# EAGLE design Estimulema v2 (EAGLE 9.2.2)

## Sheet 1 of 5
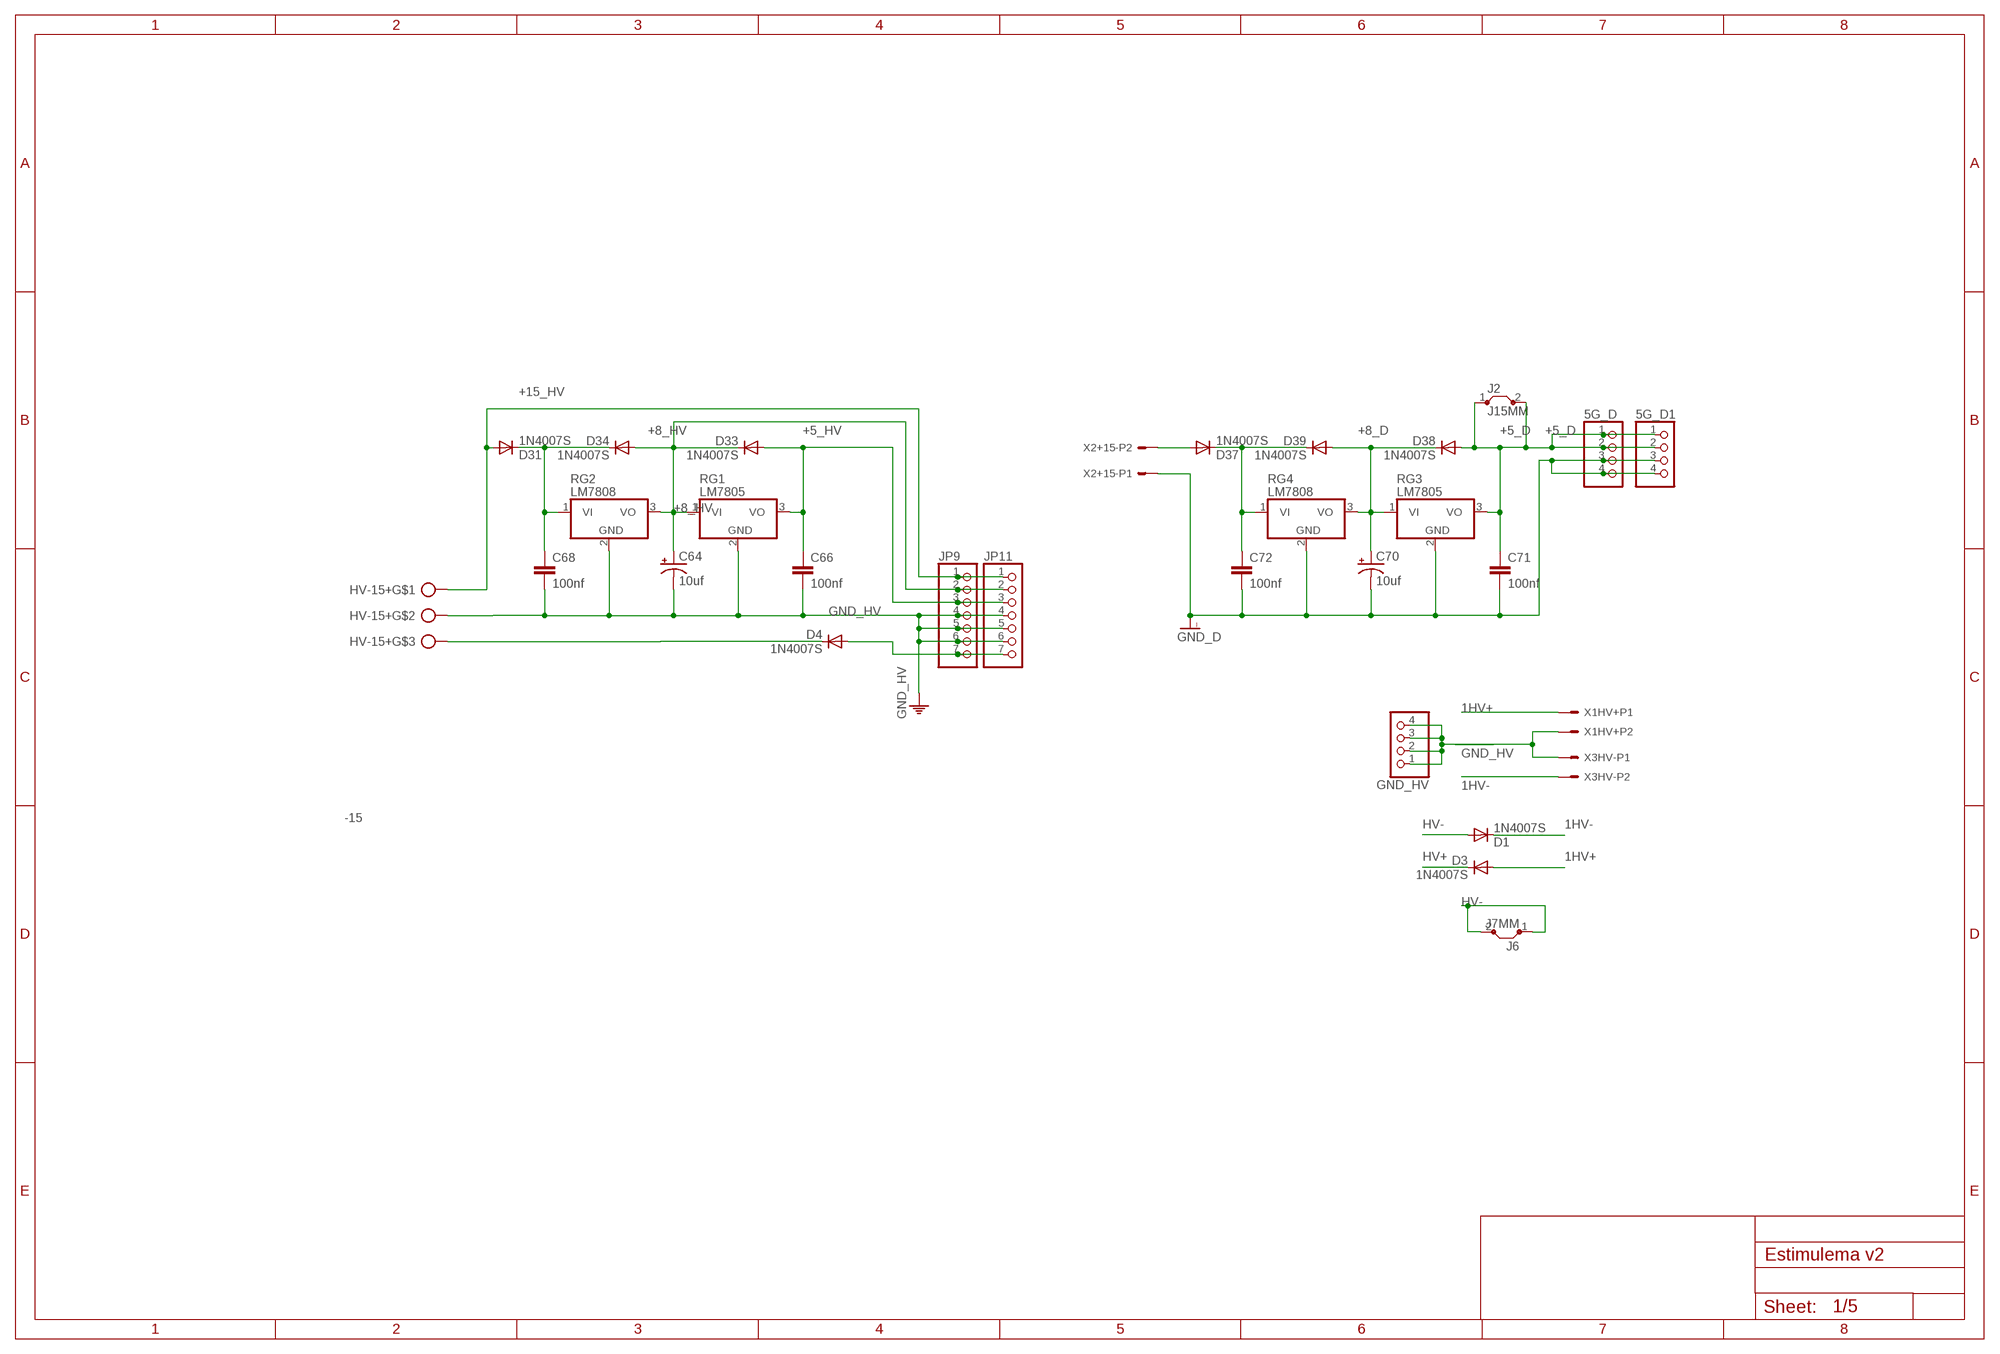
[diagram p0: schematic, sheet 1]

### Parts
5G_D  PINHD-1X4  [1X04]
5G_D1  PINHD-1X4  [1X04]
C64  10uf  CPOL-USE2-5  [E2-5]
C66  100nf  C-EU025-025X050  [C025-025X050]
C68  100nf  C-EU025-025X050  [C025-025X050]
C70  10uf  CPOL-USE2-5  [E2-5]
C71  100nf  C-EU025-025X050  [C025-025X050]
C72  100nf  C-EU025-025X050  [C025-025X050]
D1  1N4007S  DIODOWEB  [RESM4226X229]
D3  1N4007S  DIODOWEB  [RESM4226X229]
D4  1N4007S  DIODOWEB  [RESM4226X229]
D31  1N4007S  DIODOWEB  [RESM4226X229]
D33  1N4007S  DIODOWEB  [RESM4226X229]
D34  1N4007S  DIODOWEB  [RESM4226X229]
D37  1N4007S  DIODOWEB  [RESM4226X229]
D38  1N4007S  DIODOWEB  [RESM4226X229]
D39  1N4007S  DIODOWEB  [RESM4226X229]
GND_HV  PINHD-1X4  [1X04]
HV-15+  CONECTOR_3_PTR500  [PTR_AK300/3]
J2  J15MM  JUMPERS15MM  [15]
J6  J7MM  JUMPERS7MM  [07]
JP9  PINHD-1X7  [1X07]
JP11  PINHD-1X7  [1X07]
RG1  LM7805  78XX_V2  [TO220V]
RG2  LM7808  78XX_V2  [TO220V]
RG3  LM7805  78XX_V2  [TO220V]
RG4  LM7808  78XX_V2  [TO220V]
X1HV+  CONECTOR_5.08  [CONECTOR_X2_5.08]
X2+15-  CONECTOR_5.08  [CONECTOR_X2_5.08]
X3HV-  CONECTOR_5.08  [CONECTOR_X2_5.08]

### Nets
1HV+ [GND_D]: D3.AN(A) X1HV+.1
1HV- [GND_D]: D1.CA(C) X3HV-.2
+5_D [+5_D]: 5G_D1.1 5G_D1.2 5G_D.1 5G_D.2 C71.1 D38.AN(A) J2.1 J2.2 RG3.3(VO) ; also sheet 2,5
+5_HV [+5_D]: C66.1 D33.AN(A) JP9.3 JP11.3 RG1.3(VO) ; also sheet 2
+8_D [SIGNAL]: C70.+ D38.CA(C) D39.AN(A) RG3.1(VI) RG4.3(VO)
+8_HV [SIGNAL]: C64.+ D33.CA(C) D34.AN(A) JP9.2 JP11.2 RG1.1(VI) RG2.3(VO)
+15_HV [SIGNAL]: D31.AN(A) HV-15+.1 JP9.1 JP11.1 ; also sheet 3,4
-15 [SIGNAL]: D4.CA(C) HV-15+.3
-15_HV [SIGNAL]: D4.AN(A) JP9.7 JP11.7 ; also sheet 3,4
GND_D [GND_D]: 5G_D1.3 5G_D1.4 5G_D.3 5G_D.4 C70.- C71.2 C72.2 RG3.2(GND) RG4.2(GND) X2+15-.1 ; also sheet 2,5
GND_HV [GND_HV]: C64.- C66.2 C68.2 GND_HV.1 GND_HV.2 GND_HV.3 GND_HV.4 HV-15+.2 JP9.4 JP9.5 JP9.6 JP11.4 JP11.5 JP11.6 RG1.2(GND) RG2.2(GND) X1HV+.2 X3HV-.1 ; also sheet 2,3,4,5
HV+ [GND_D]: D3.CA(C) ; also sheet 3,4
HV- [GND_D]: D1.AN(A) J6.1 J6.2 ; also sheet 3,4
N$9: D37.AN(A) X2+15-.2
N$157 [SIGNAL]: C68.1 D31.CA(C) D34.CA(C) RG2.1(VI)
N$158 [SIGNAL]: C72.1 D37.CA(C) D39.CA(C) RG4.1(VI)

## Sheet 2 of 5
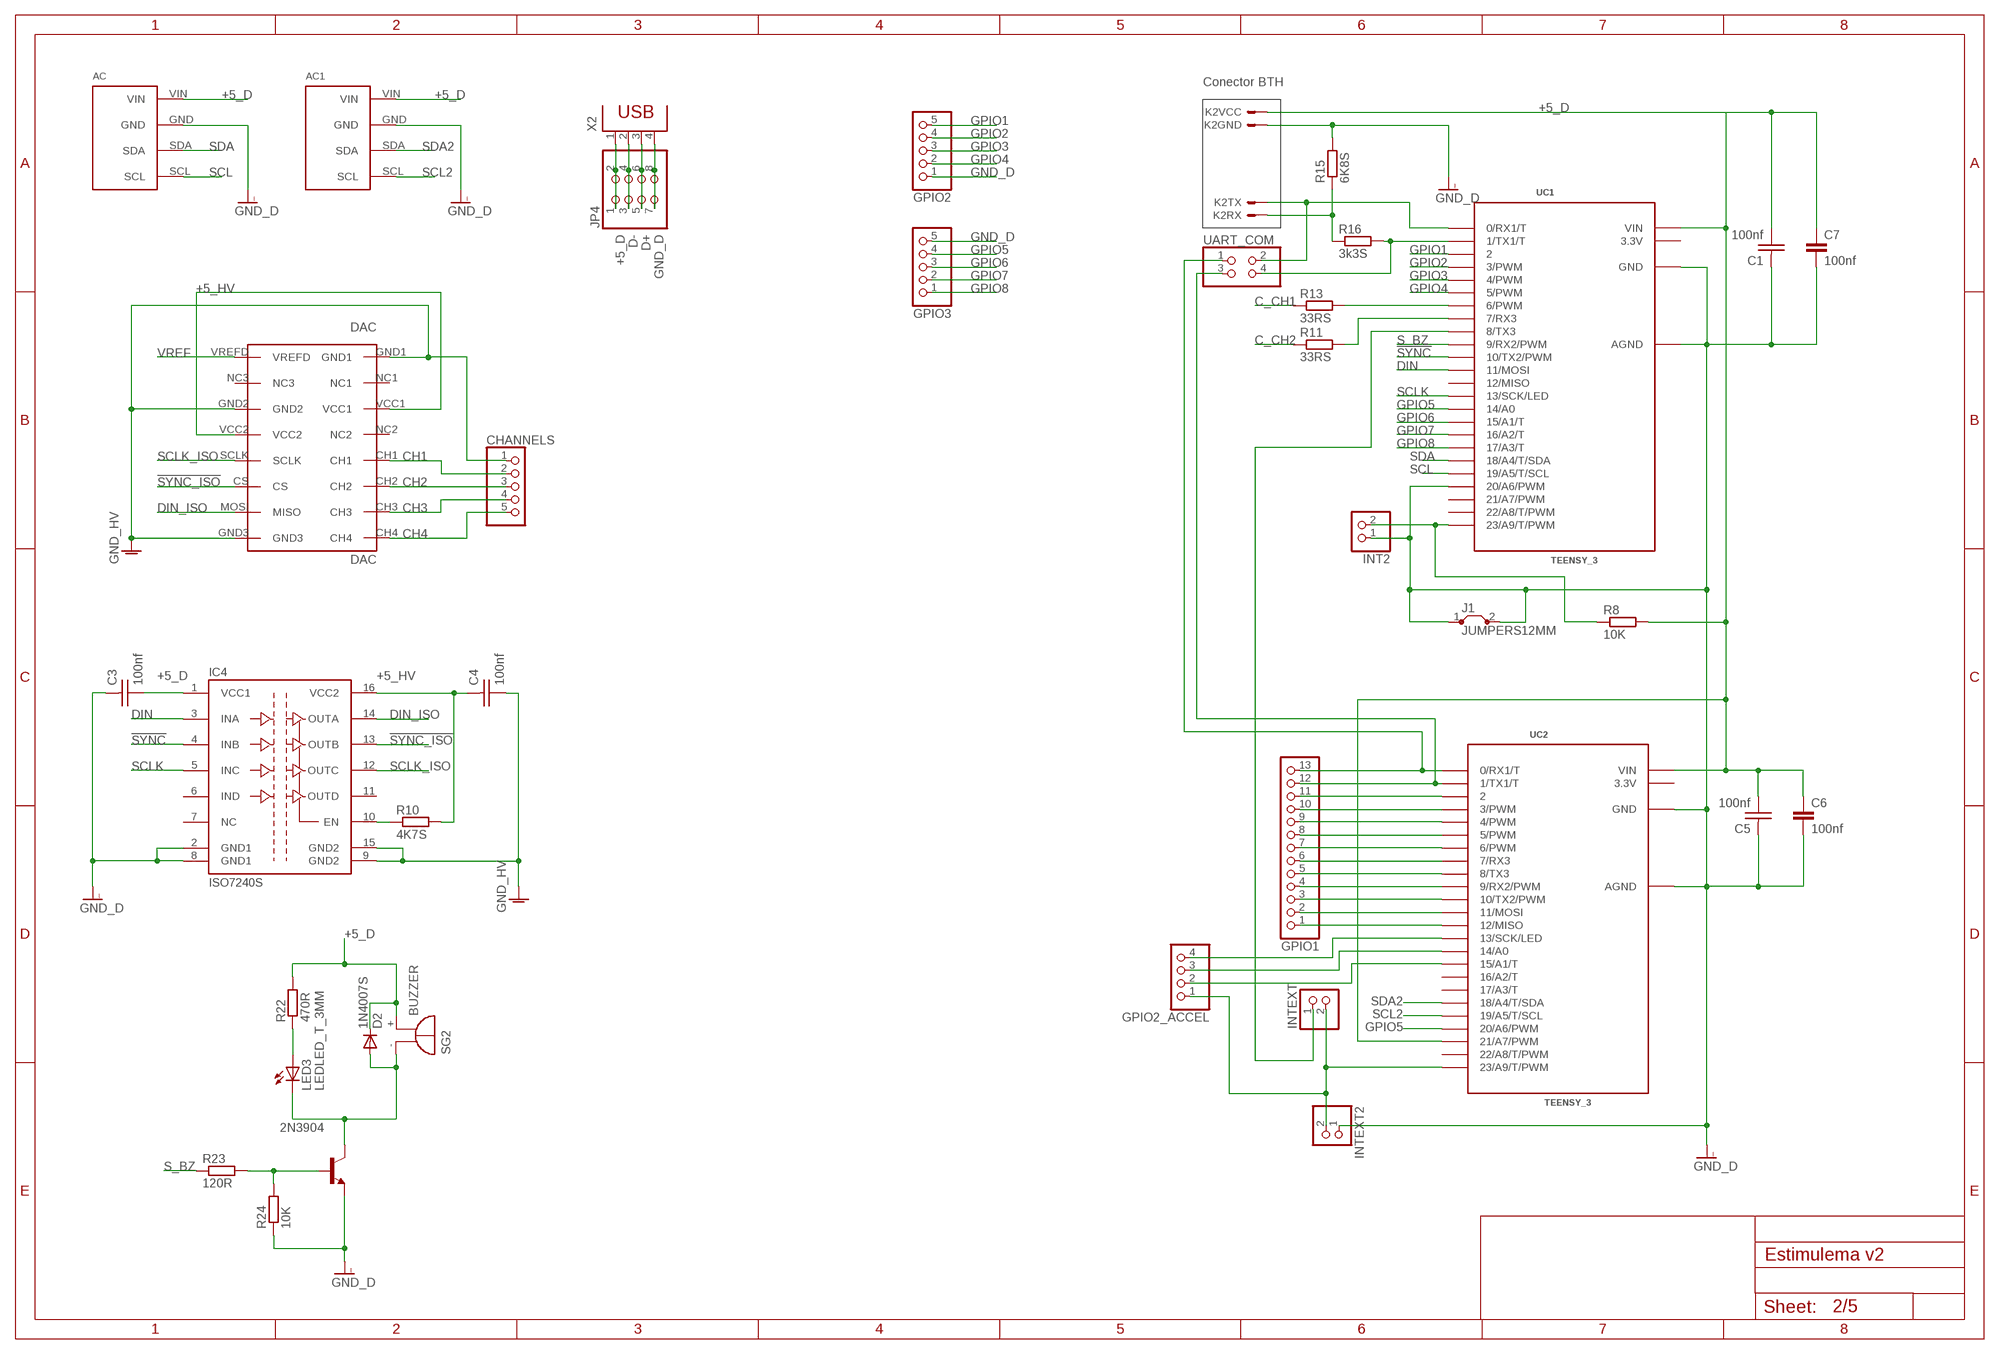
[diagram p1: schematic, sheet 2]

### Parts
2N3904  29-NPN-TO92-EBC  [TO92-EBC]
AC  CONECTOR_ACELEROMETRO_MPU6050CONECTOR_MPU6050  [MPU6050]
AC1  MPU6050  CONECTOR_ACELEROMETRO_MPU6050CONECTOR_MPU6050  [MPU6050]
C1  100nf  CAP_CERAMICO_SMD  [CAP_CER_SMD-0805]
C3  100nf  CAP_CERAMICO_SMD  [CAP_CER_SMD-0805]
C4  100nf  CAP_CERAMICO_SMD  [CAP_CER_SMD-0805]
C5  100nf  CAP_CERAMICO_SMD  [CAP_CER_SMD-0805]
C6  100nf  C-EU025-025X050  [C025-025X050]
C7  100nf  C-EU025-025X050  [C025-025X050]
CHANNELS  PINHD-1X5  [1X05]
D2  1N4007S  DIODOWEB  [RESM4226X229]
DAC  DAC  DAC_MODULE  [DACMOD_P]
GPIO1  PINHD-1X13  [1X13]
GPIO2  PINHD-1X5  [1X05]
GPIO2_ACCEL  PINHD-1X4  [1X04]
GPIO3  PINHD-1X5  [1X05]
IC4  ISO7240S  ISO7240_SMDDW  [SO-16DW]
INT2  PINHD-1X2  [1X02]
INTEXT  PINHD-1X2  [1X02]
INTEXT2  PINHD-1X2  [1X02]
J1  JUMPERS12MM  [12]
JP4  PINHD-2X4  [2X04]
K2  HC-06  CONECTOR_BTHC-06HC-06  [CONECTOR_BTHC-06]
LED3  LEDLED_T_3MM  [LED3MM]
R8  10K  RESISTORSMD_0805  [RESISTENCIA_0805]
R10  4K7S  RESISTORSMD_0805  [RESISTENCIA_0805]
R11  33RS  RESISTORSMD_0805  [RESISTENCIA_0805]
R13  33RS  RESISTORSMD_0805  [RESISTENCIA_0805]
R15  6K8S  RESISTORSMD_0805  [RESISTENCIA_0805]
R16  3k3S  RESISTORSMD_0805  [RESISTENCIA_0805]
R22  470R  RESISTORSMD_0805  [RESISTENCIA_0805]
R23  120R  RESISTORSMD_0805  [RESISTENCIA_0805]
R24  10K  RESISTORSMD_0805  [RESISTENCIA_0805]
SG2  BUZZER  [BUZZER]
UART_COM  PINHD-2X2  [2X02]
UC1  TEENSY_3  TEENSY_3.0_A_3.2VERSION_MINIMA  [TEENSY_3.0-3.2_DIL]
UC2  TEENSY_3  TEENSY_3.0_A_3.2VERSION_MINIMA  [TEENSY_3.0-3.2_DIL]
X2  PN61729  [PN61729]

### Nets
!SYNC [SIGNAL]: IC4.4(INB) UC1.10(10/TX2/PWM)
!SYNC_ISO [SIGNAL]: DAC.CS IC4.13(OUTB)
+5_D [+5_D]: AC1.VIN AC.VIN C1.2 C3.2 C5.2 C6.1 C7.1 D2.CA(C) IC4.1(VCC1) JP4.1 JP4.2 K2.1 R8.2 R22.2 SG2.+(-) UC1.VIN UC2.21/A7(21/A7/PWM) UC2.VIN X2.1 ; also sheet 1,5
+5_HV [+5_D]: C4.1 DAC.VCC1 DAC.VCC2 IC4.16(VCC2) R10.2 ; also sheet 1
C_15D [SIGNAL]: GPIO1.11 UC2.2
C_CH1 [SIGNAL]: R13.1 ; also sheet 5
C_CH2 [SIGNAL]: R11.1 ; also sheet 5
CH1 [SIGNAL]: CHANNELS.2 DAC.CH1 ; also sheet 3
CH2 [SIGNAL]: CHANNELS.3 DAC.CH2 ; also sheet 4
CH3 [SIGNAL]: CHANNELS.4 DAC.CH3
CH4 [SIGNAL]: CHANNELS.5 DAC.CH4
D+ [SIGNAL]: JP4.5 JP4.6 X2.3
D- [SIGNAL]: JP4.3 JP4.4 X2.2
DIN [SIGNAL]: IC4.3(INA) UC1.11(11/MOSI)
DIN_ISO [SIGNAL]: DAC.MOSI(MISO) IC4.14(OUTA)
GND_D [GND_D]: 2N3904.E AC1.GND AC.GND C1.1 C3.1 C5.1 C6.2 C7.2 GPIO2.1 GPIO3.5 IC4.2(GND1) IC4.8(GND1) INT2.1 INTEXT2.1 J1.1 J1.2 JP4.7 JP4.8 K2.2 R15.2 R24.1 UC1.20/A6(20/A6/PWM) UC1.AGND UC1.GND UC2.AGND UC2.GND X2.4 ; also sheet 1,5
GND_HV [GND_HV]: C4.2 CHANNELS.1 DAC.GND1 DAC.GND2 DAC.GND3 IC4.9(GND2) IC4.15(GND2) ; also sheet 1,3,4,5
GPIO1 [SIGNAL]: GPIO2.5 UC1.2
GPIO2 [SIGNAL]: GPIO2.4 UC1.3(3/PWM)
GPIO3 [SIGNAL]: GPIO2.3 UC1.4(4/PWM)
GPIO4 [SIGNAL]: GPIO2.2 UC1.5(5/PWM)
GPIO5 [SIGNAL]: GPIO3.4 UC1.14/A0 UC2.20/A6(20/A6/PWM)
GPIO6 [SIGNAL]: GPIO3.3 UC1.15/A1(15/A1/T)
GPIO7 [SIGNAL]: GPIO3.2 UC1.16/A2(16/A2/T)
GPIO8 [SIGNAL]: GPIO3.1 UC1.17/A3(17/A3/T)
N$1: GPIO2_ACCEL.1 INTEXT2.2 INTEXT.2 UC2.23/A9(23/A9/T/PWM)
N$5: INTEXT.1 UC1.8(8/TX3)
N$6: GPIO1.13 UART_COM.1 UC2.0(0/RX1/T)
N$7: GPIO1.12 UART_COM.3 UC2.1(1/TX1/T)
N$10: GPIO1.10 UC2.3(3/PWM)
N$11: GPIO1.9 UC2.4(4/PWM)
N$12: GPIO1.8 UC2.5(5/PWM)
N$14: GPIO1.7 UC2.6(6/PWM)
N$15: GPIO1.6 UC2.7(7/RX3)
N$19: GPIO1.5 UC2.8(8/TX3)
N$20: GPIO1.4 UC2.9(9/RX2/PWM)
N$21: GPIO1.3 UC2.10(10/TX2/PWM)
N$22: GPIO1.2 UC2.11(11/MOSI)
N$23: GPIO1.1 UC2.12(12/MISO)
N$36: R16.2 UART_COM.4 UC1.1(1/TX1/T)
N$37: GPIO2_ACCEL.4 UC2.13(13/SCK/LED)
N$38: K2.3 UART_COM.2 UC1.0(0/RX1/T)
N$39: GPIO2_ACCEL.3 UC2.14/A0
N$40: GPIO2_ACCEL.2 UC2.15/A1(15/A1/T)
N$66 [SIGNAL]: IC4.10(EN) R10.1
N$69 [SIGNAL]: K2.4 R15.1 R16.1
N$72 [SIGNAL]: LED3.A R22.1
N$73 [SIGNAL]: 2N3904.C D2.AN(A) LED3.K(C) SG2.-(+)
N$74 [SIGNAL]: 2N3904.B R23.2 R24.2
N$75 [SIGNAL]: INT2.2 R8.1 UC1.23/A9(23/A9/T/PWM)
RL1 [SIGNAL]: R13.2 UC1.6(6/PWM)
RL2 [SIGNAL]: R11.2 UC1.7(7/RX3)
S_BZ [SIGNAL]: R23.1 UC1.9(9/RX2/PWM)
SCL [SIGNAL]: AC.SCL UC1.19/A5(19/A5/T/SCL)
SCL2: AC1.SCL UC2.19/A5(19/A5/T/SCL)
SCLK [SIGNAL]: IC4.5(INC) UC1.13(13/SCK/LED)
SCLK_ISO [SIGNAL]: DAC.SCLK IC4.12(OUTC)
SDA [SIGNAL]: AC.SDA UC1.18/A4(18/A4/T/SDA)
SDA2: AC1.SDA UC2.18/A4(18/A4/T/SDA)
VREF [SIGNAL]: DAC.VREFD ; also sheet 3,4
Unconnected: DAC.NC1 DAC.NC2 DAC.NC3 IC4.6(IND) IC4.7(NC) IC4.11(OUTD) UC1.12(12/MISO) UC1.21/A7(21/A7/PWM) UC1.22/A8(22/A8/T/PWM) UC2.16/A2(16/A2/T) UC2.17/A3(17/A3/T) UC2.22/A8(22/A8/T/PWM)

### Notes on the sheet
- Conector BTH

## Sheet 3 of 5
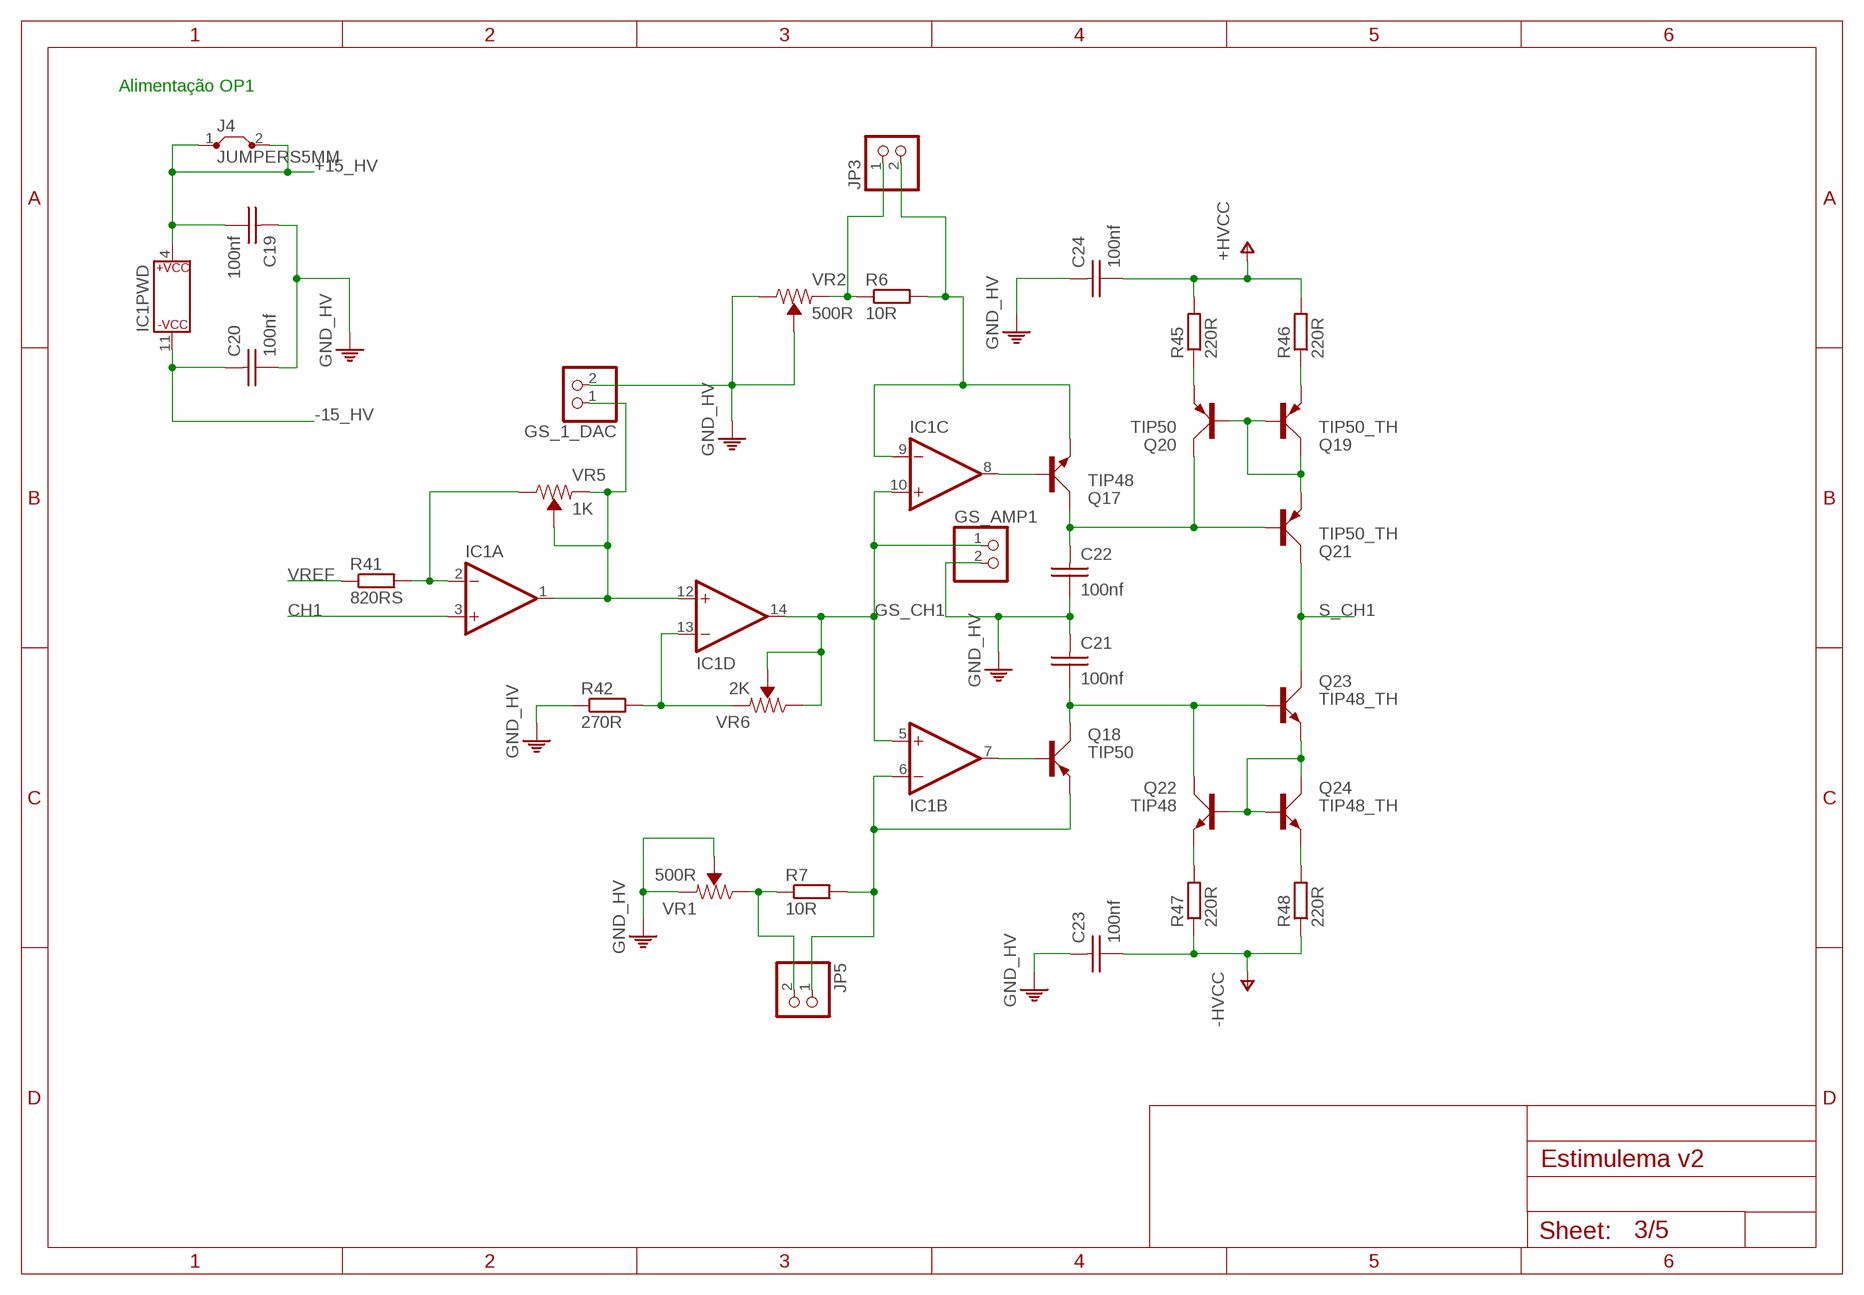
[diagram p2: schematic, sheet 3]

### Parts
C19  100nf  CAP_CERAMICO_SMD  [CAP_CER_SMD-0805]
C20  100nf  CAP_CERAMICO_SMD  [CAP_CER_SMD-0805]
C21  100nf  CAP_CERAMICO_TH2  [CAP_CER_2,54-5X5]
C22  100nf  CAP_CERAMICO_TH2  [CAP_CER_2,54-5X5]
C23  100nf  CAP_CERAMICO_TH16  [CAP_CER_16X7]
C24  100nf  CAP_CERAMICO_TH16  [CAP_CER_16X7]
GS_1_DAC  PINHD-1X2  [1X02]
GS_AMP1  PINHD-1X2  [1X02]
IC1  TL084DIL143D  [DIL14]
J4  JUMPERS5MM  [05]
JP3  PINHD-1X2  [1X02]
JP5  PINHD-1X2  [1X02]
Q17  TIP48  TIP48_TH  [TO220]
Q18  TIP50  TIP50_TH  [TO220]
Q19  TIP50_TH  [TO220]
Q20  TIP50  TIP50_TH  [TO220]
Q21  TIP50_TH  [TO220]
Q22  TIP48  TIP48_TH  [TO220]
Q23  TIP48_TH  [TO220]
Q24  TIP48_TH  [TO220]
R6  10R  RESISTORSMD_0805  [RESISTENCIA_0805]
R7  10R  RESISTORSMD_0805  [RESISTENCIA_0805]
R41  820RS  RESISTORSMD_0805  [RESISTENCIA_0805]
R42  270R  RESISTORSMD_0805  [RESISTENCIA_0805]
R45  220R  RESISTORT_CORTO  [0204V]
R46  220R  RESISTORT_CORTO  [0204V]
R47  220R  RESISTORT_CORTO  [0204V]
R48  220R  RESISTORT_CORTO  [0204V]
VR1  500R  TRIMPOT_TH  [TRIMPOT-PTH-3386U]
VR2  500R  TRIMPOT_TH  [TRIMPOT-PTH-3386U]
VR5  1K  TRIMPOT_TH  [TRIMPOT-PTH-3386U]
VR6  2K  TRIMPOT_TH  [TRIMPOT-PTH-3386U]

### Nets
+15_HV [SIGNAL]: C19.2 IC1.4(PWD:P$V+) J4.1 J4.2 ; also sheet 1,4
-15_HV [SIGNAL]: C20.1 IC1.11(PWD:P$V-) ; also sheet 1,4
CH1 [SIGNAL]: IC1.3(A:+IN) ; also sheet 2
GND_HV [GND_HV]: C19.1 C20.2 C21.1 C22.2 C23.1 C24.1 GS_1_DAC.2 GS_AMP1.2 R42.1 VR1.1(CCW) VR1.2(WIPER) VR2.2(WIPER) VR2.3(CW) ; also sheet 1,2,4,5
GS_CH1 [SIGNAL]: GS_AMP1.1 IC1.5(B:+IN) IC1.10(C:+IN) IC1.14(D:OUT) VR6.2(WIPER) VR6.3(CW)
HV+ [GND_D]: C24.2 R45.2 R46.2 ; supply symbol labelled +HVCC ; also sheet 1,4
HV- [GND_D]: C23.2 R47.1 R48.1 ; supply symbol labelled -HVCC ; also sheet 1,4
N$24: JP5.2 R7.1 VR1.3(CW)
N$27: JP3.1 R6.1 VR2.1(CCW)
N$106 [SIGNAL]: IC1.2(A:-IN) R41.2 VR5.3(CW)
N$107 [SIGNAL]: GS_1_DAC.1 IC1.1(A:OUT) IC1.12(D:+IN) VR5.1(CCW) VR5.2(WIPER)
N$108 [SIGNAL]: IC1.13(D:-IN) R42.2 VR6.1(CCW)
N$109 [SIGNAL]: IC1.9(C:-IN) JP3.2 Q17.E R6.2
N$110 [SIGNAL]: IC1.6(B:-IN) JP5.1 Q18.E R7.2
N$111 [SIGNAL]: C21.2 Q18.C Q22.C Q23.B
N$112 [SIGNAL]: C22.1 Q17.C Q20.C Q21.B
N$113 [SIGNAL]: Q20.E R45.1
N$114 [GND_HV1]: Q19.E R46.1
N$115 [GND_HV1]: Q19.B Q19.C Q20.B Q21.E
N$116 [GND_HV1]: Q22.B Q23.E Q24.B Q24.C
N$117 [SIGNAL]: Q22.E R47.2
N$118 [GND_HV1]: Q24.E R48.2
N$119 [SIGNAL]: IC1.8(C:OUT) Q17.B
N$120 [SIGNAL]: IC1.7(B:OUT) Q18.B
S_CH1 [GND_HV1]: Q21.C Q23.C ; also sheet 5
VREF [SIGNAL]: R41.1 ; also sheet 2,4

### Notes on the sheet
- Alimentação OP1

## Sheet 4 of 5
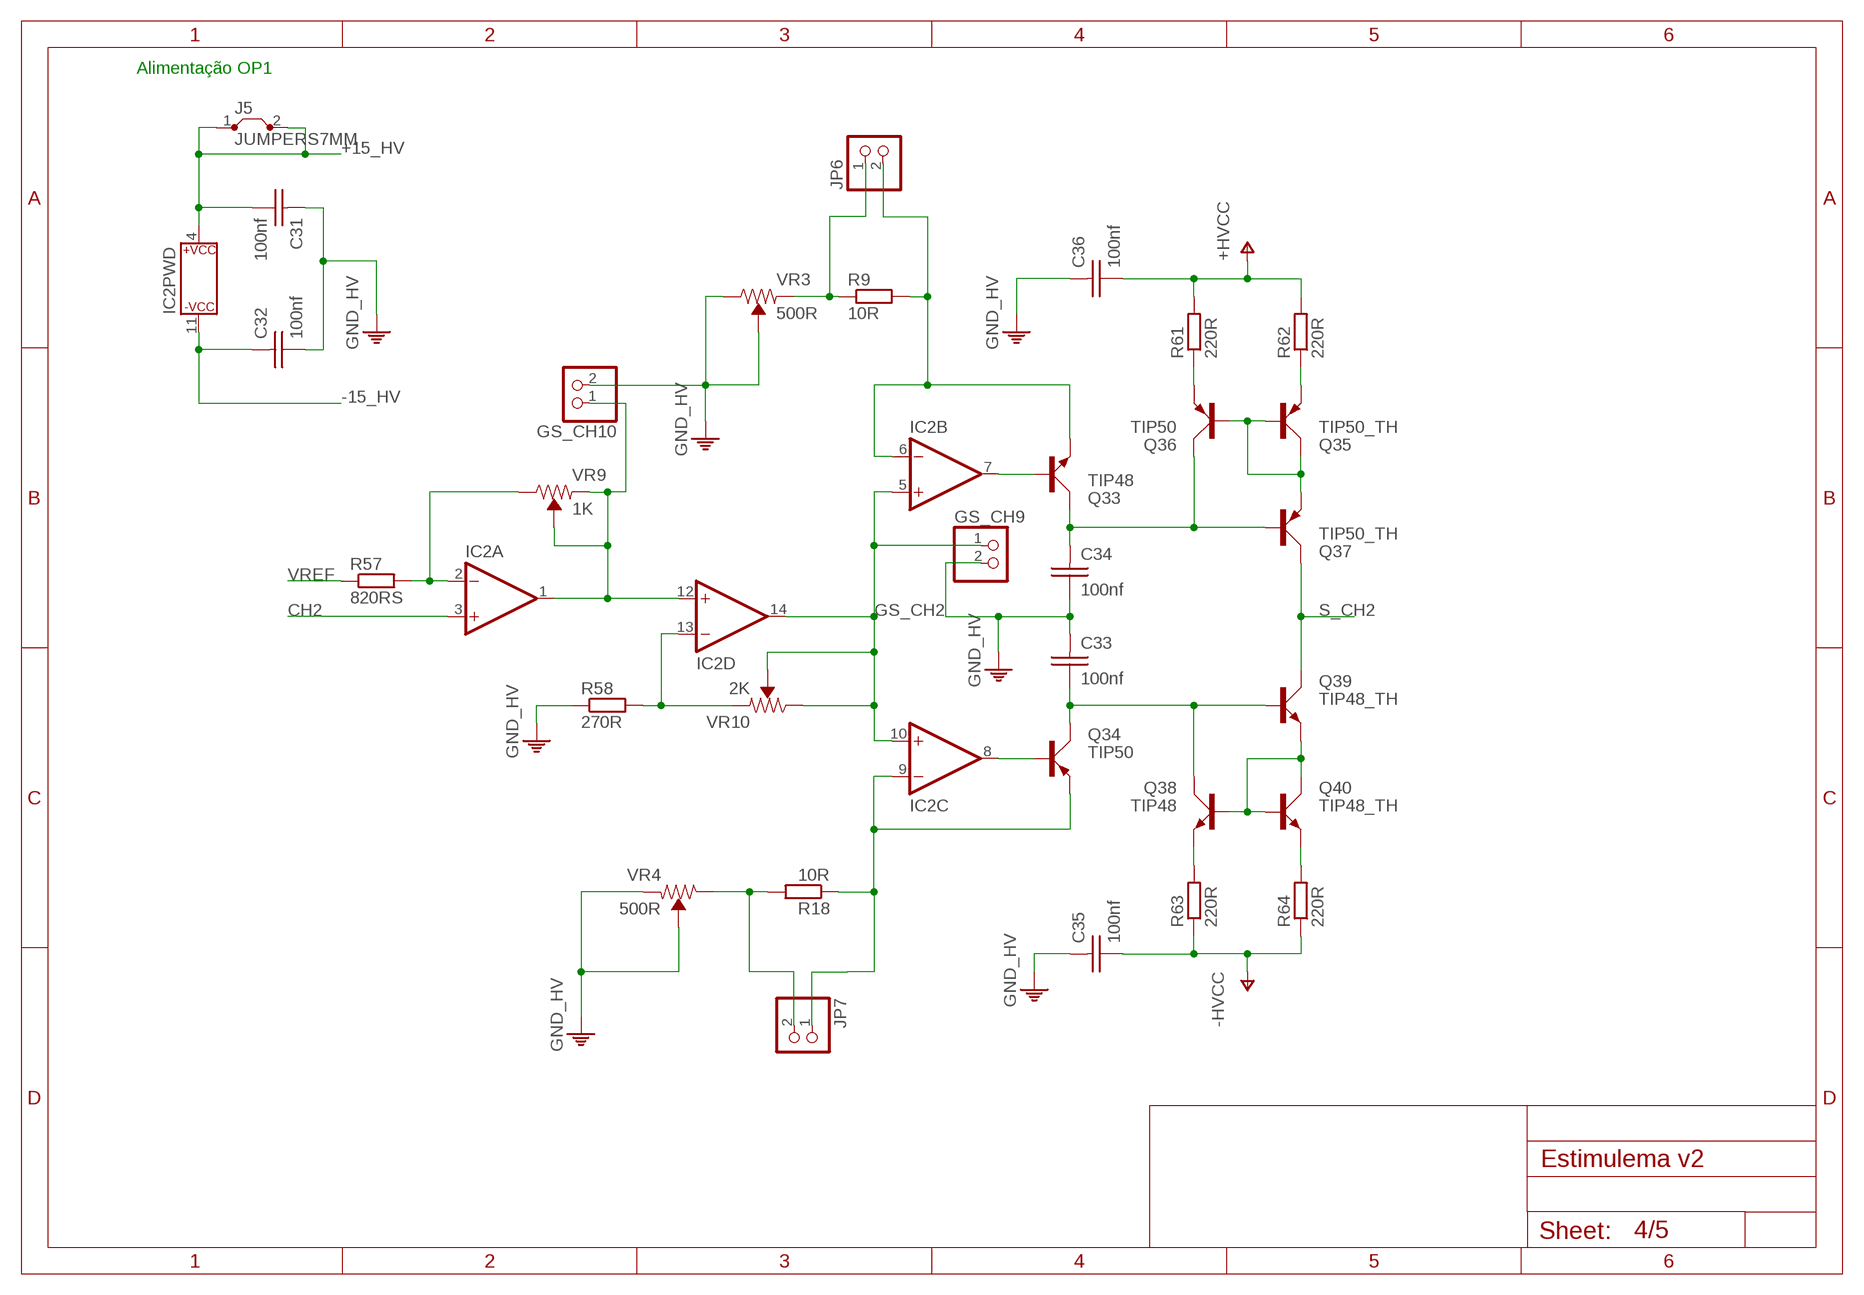
[diagram p3: schematic, sheet 4]

### Parts
C31  100nf  CAP_CERAMICO_SMD  [CAP_CER_SMD-0805]
C32  100nf  CAP_CERAMICO_SMD  [CAP_CER_SMD-0805]
C33  100nf  CAP_CERAMICO_TH2  [CAP_CER_2,54-5X5]
C34  100nf  CAP_CERAMICO_TH2  [CAP_CER_2,54-5X5]
C35  100nf  CAP_CERAMICO_TH16  [CAP_CER_16X7]
C36  100nf  CAP_CERAMICO_TH16  [CAP_CER_16X7]
GS_CH9  PINHD-1X2  [1X02]
GS_CH10  PINHD-1X2  [1X02]
IC2  TL084DIL143D  [DIL14]
J5  JUMPERS7MM  [07]
JP6  PINHD-1X2  [1X02]
JP7  PINHD-1X2  [1X02]
Q33  TIP48  TIP48_TH  [TO220]
Q34  TIP50  TIP50_TH  [TO220]
Q35  TIP50_TH  [TO220]
Q36  TIP50  TIP50_TH  [TO220]
Q37  TIP50_TH  [TO220]
Q38  TIP48  TIP48_TH  [TO220]
Q39  TIP48_TH  [TO220]
Q40  TIP48_TH  [TO220]
R9  10R  RESISTORSMD_0805  [RESISTENCIA_0805]
R18  10R  RESISTORSMD_0805  [RESISTENCIA_0805]
R57  820RS  RESISTORSMD_0805  [RESISTENCIA_0805]
R58  270R  RESISTORSMD_0805  [RESISTENCIA_0805]
R61  220R  RESISTORT_CORTO  [0204V]
R62  220R  RESISTORT_CORTO  [0204V]
R63  220R  RESISTORT_CORTO  [0204V]
R64  220R  RESISTORT_CORTO  [0204V]
VR3  500R  TRIMPOT_TH  [TRIMPOT-PTH-3386U]
VR4  500R  TRIMPOT_TH  [TRIMPOT-PTH-3386U]
VR9  1K  TRIMPOT_TH  [TRIMPOT-PTH-3386U]
VR10  2K  TRIMPOT_TH  [TRIMPOT-PTH-3386U]

### Nets
+15_HV [SIGNAL]: C31.2 IC2.4(PWD:P$V+) J5.1 J5.2 ; also sheet 1,3
-15_HV [SIGNAL]: C32.1 IC2.11(PWD:P$V-) ; also sheet 1,3
CH2 [SIGNAL]: IC2.3(A:+IN) ; also sheet 2
GND_HV [GND_HV]: C31.1 C32.2 C33.1 C34.2 C35.1 C36.1 GS_CH9.2 GS_CH10.2 R58.1 VR3.2(WIPER) VR3.3(CW) VR4.1(CCW) VR4.2(WIPER) ; also sheet 1,2,3,5
GS_CH2 [SIGNAL]: GS_CH9.1 IC2.5(B:+IN) IC2.10(C:+IN) IC2.14(D:OUT) VR10.2(WIPER) VR10.3(CW)
HV+ [GND_D]: C36.2 R61.2 R62.2 ; supply symbol labelled +HVCC ; also sheet 1,3
HV- [GND_D]: C35.2 R63.1 R64.1 ; supply symbol labelled -HVCC ; also sheet 1,3
N$28 [SIGNAL]: IC2.6(B:-IN) JP6.2 Q33.E R9.2
N$29: JP6.1 R9.1 VR3.1(CCW)
N$30 [SIGNAL]: JP7.2 R18.2 VR4.3(CW)
N$31: IC2.9(C:-IN) JP7.1 Q34.E R18.1
N$136 [SIGNAL]: IC2.2(A:-IN) R57.2 VR9.3(CW)
N$137 [SIGNAL]: GS_CH10.1 IC2.1(A:OUT) IC2.12(D:+IN) VR9.1(CCW) VR9.2(WIPER)
N$138 [SIGNAL]: IC2.13(D:-IN) R58.2 VR10.1(CCW)
N$141 [SIGNAL]: C33.2 Q34.C Q38.C Q39.B
N$142 [SIGNAL]: C34.1 Q33.C Q36.C Q37.B
N$143 [SIGNAL]: Q36.E R61.1
N$144 [GND_HV1]: Q35.E R62.1
N$145 [GND_HV1]: Q35.B Q35.C Q36.B Q37.E
N$146 [GND_HV1]: Q38.B Q39.E Q40.B Q40.C
N$147 [SIGNAL]: Q38.E R63.2
N$148 [GND_HV1]: Q40.E R64.2
N$149 [SIGNAL]: IC2.7(B:OUT) Q33.B
N$150 [SIGNAL]: IC2.8(C:OUT) Q34.B
S_CH2 [SIGNAL]: Q37.C Q39.C ; also sheet 5
VREF [SIGNAL]: R57.1 ; also sheet 2,3

### Notes on the sheet
- Alimentação OP1

## Sheet 5 of 5
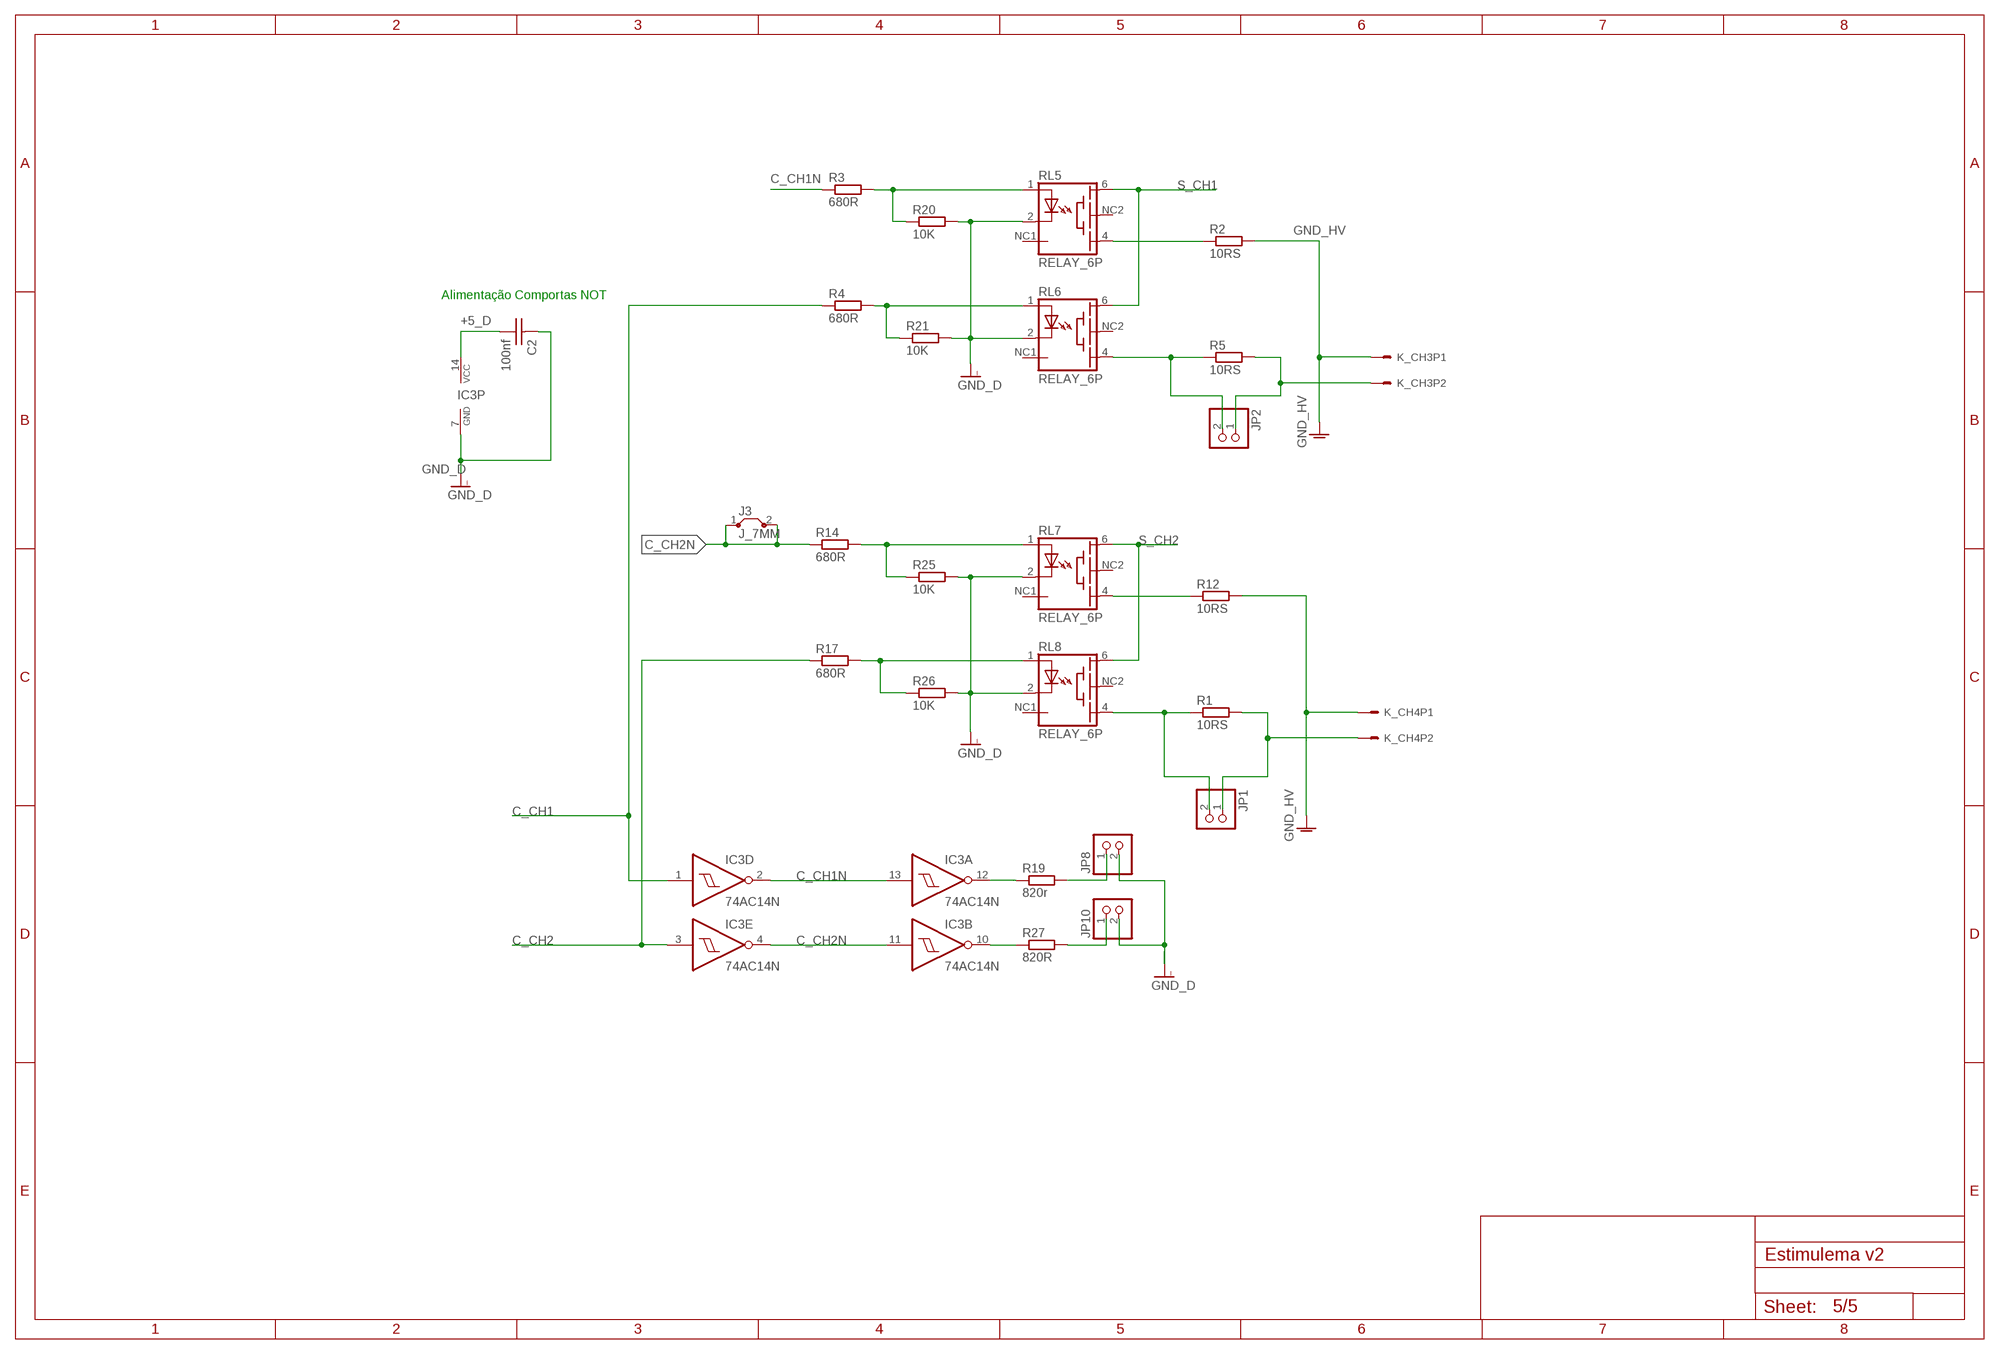
[diagram p4: schematic, sheet 5]

### Parts
C2  100nf  CAP_CERAMICO_SMD  [CAP_CER_SMD-0805]
IC3  74AC14N  [DIL14]
J3  J_7MM  JUMPERS7MM  [07]
JP1  PINHD-1X2  [1X02]
JP2  PINHD-1X2  [1X02]
JP8  PINHD-1X2  [1X02]
JP10  PINHD-1X2  [1X02]
K_CH3  CONECTOR_5.08  [CONECTOR_X2_5.08]
K_CH4  CONECTOR_5.08  [CONECTOR_X2_5.08]
R1  10RS  RESISTORT_LARGO  [0204/5]
R2  10RS  RESISTORT_GRANDE  [0617V]
R3  680R  RESISTORSMD_0805  [RESISTENCIA_0805]
R4  680R  RESISTORSMD_0805  [RESISTENCIA_0805]
R5  10RS  RESISTORT_LARGO  [0204/5]
R12  10RS  RESISTORT_GRANDE  [0617V]
R14  680R  RESISTORSMD_0805  [RESISTENCIA_0805]
R17  680R  RESISTORSMD_0805  [RESISTENCIA_0805]
R19  820r  RESISTORSMD_0805  [RESISTENCIA_0805]
R20  10K  RESISTORSMD_0805  [RESISTENCIA_0805]
R21  10K  RESISTORSMD_0805  [RESISTENCIA_0805]
R25  10K  RESISTORSMD_0805  [RESISTENCIA_0805]
R26  10K  RESISTORSMD_0805  [RESISTENCIA_0805]
R27  820R  RESISTORSMD_0805  [RESISTENCIA_0805]
RL5  RELAY_6P  [TS210]
RL6  RELAY_6P  [TS210]
RL7  RELAY_6P  [TS210]
RL8  RELAY_6P  [TS210]

### Nets
+5_D [+5_D]: C2.2 IC3.14(P:VCC) ; also sheet 1,2
C_CH1 [SIGNAL]: IC3.1(D:I) R4.1 ; also sheet 2
C_CH1N [SIGNAL]: IC3.2(D:O) IC3.13(A:I) R3.1
C_CH2 [SIGNAL]: IC3.3(E:I) R17.1 ; also sheet 2
C_CH2N [SIGNAL]: IC3.4(E:O) IC3.11(B:I) J3.1 J3.2 R14.1
GND_D [GND_D]: C2.1 IC3.7(P:GND) JP8.2 JP10.2 R20.2 R21.2 R25.2 R26.2 RL5.2(C) RL6.2(C) RL7.2(C) RL8.2(C) ; also sheet 1,2
GND_HV [GND_HV]: K_CH3.1 K_CH4.1 R2.2 R12.2 ; also sheet 1,2,3,4
N$2 [SIGNAL]: R3.2 R20.1 RL5.1(A)
N$3 [SIGNAL]: R4.2 R21.1 RL6.1(A)
N$4 [GND_HV1]: R2.1 RL5.4(EMI)
N$8: JP2.2 R5.1 RL6.4(EMI)
N$13 [SIGNAL]: R14.2 R25.1 RL7.1(A)
N$16 [SIGNAL]: R17.2 R26.1 RL8.1(A)
N$17 [GND_HV1]: R12.1 RL7.4(EMI)
N$18: JP2.1 K_CH3.2 R5.2
N$25: JP1.1 K_CH4.2 R1.2
N$26: JP1.2 R1.1 RL8.4(EMI)
N$32: JP8.1 R19.2
N$33: IC3.12(A:O) R19.1
N$34: IC3.10(B:O) R27.1
N$35: JP10.1 R27.2
S_CH1 [GND_HV1]: RL5.6(BAS) RL6.6(BAS) ; also sheet 3
S_CH2 [SIGNAL]: RL7.6(BAS) RL8.6(BAS) ; also sheet 4
Unconnected: IC3.5(F:I) IC3.6(F:O) IC3.8(C:O) IC3.9(C:I) RL5.NC1 RL5.NC2 RL6.NC1 RL6.NC2 RL7.NC1 RL7.NC2 RL8.NC1 RL8.NC2

### Notes on the sheet
- Alimentação Comportas NOT

## Power pins joined to a net without a drawn wire
3.3V: UC1.3.3V UC2.3.3V

## Library data of the parts
2N3904 = transistor:*-NPN-: NPN Transistror BF959 corrected 2008.03.06
5G_D 5G_D1 GND_HV GPIO2_ACCEL = pinhead:PINHD-1X4: PIN HEADER
AC AC1 = 7DI Library:CONECTOR_ACELEROMETRO_MPU6050: Conector para el Acelerometro MPU6050 I2C
C1-C5 C19-C24 C31-C36 = 7DI Library:CAP_CERAMICO: Capacitores ceramicos y de poliester, entre otros
C6 C7 C66 C68 C71 C72 = resistor:C-EU: CAPACITOR, European symbol
C64 C70 = resistor:CPOL-US: POLARIZED CAPACITOR, American symbol
CHANNELS GPIO2 GPIO3 = pinhead:PINHD-1X5: PIN HEADER
D1-D4 D31 D33 D34 D37-D39 = 7DI Library:DIODO: Diodo usado para protecion en las fuentes de alimentacion
DAC = 7DI Library:DAC_MODULE: Modulo feito para o dac com seu regulador
GPIO1 = pinhead:PINHD-1X13: PIN HEADER
GS_1_DAC GS_AMP1 GS_CH9 GS_CH10 INT2 INTEXT INTEXT2 JP1-JP3 JP5-JP8 JP10 = pinhead:PINHD-1X2: PIN HEADER
HV-15+ = 7DI Library:CONECTOR_3_PTR500: ptr500_con 3 space of 5.08
IC1 IC2 = 7DI Library:TL084: IC TL084 Quad Op Amp
IC3 = 74xx-eu:74*14: Hex schmitt trigger INVERTER
IC4 = 7DI Library:ISO7240_SMD: ISO7240 High Speed Quad Digital Isolators
J1-J6 = 7DI Library:JUMPERS: Bridge
JP4 = pinhead:PINHD-2X4: PIN HEADER
JP9 JP11 = pinhead:PINHD-1X7: PIN HEADER
K2 = 7DI Library:CONECTOR_BTHC-06: CONECTOR DEL MODULO BLUETOOTH HC-06
K_CH3 K_CH4 X1HV+ X2+15- X3HV- = 7DI Library:CONECTOR_: Diferentes tipos de conectores
LED3 = 7DI Library:LED: Diodo led de 3, 5 mm y SMD 0805
Q17 Q22-Q24 Q33 Q38-Q40 = 7DI Library:TIP48: NPN TRANSISTOR
Q18-Q21 Q34-Q37 = 7DI Library:TIP50: PNP TRANSISTOR
R1-R27 R41 R42 R45-R48 R57 R58 R61-R64 = 7DI Library:RESISTOR: Resistor con varias variantes
RG1-RG4 = 7DI Library:78XX_V2: Reguilador positivo familia 78
RL5-RL8 = 7DI Library:RELAY_: Rele de estado solido
SG2 = 7DI Library:BUZZER: BUZZER Source: Buerklin; OC_FARNELL: unknown; OC_NEWARK: unknown
UART_COM = pinhead:PINHD-2X2: PIN HEADER
UC1 UC2 = 7DI Library:TEENSY_3.0_A_3.2: Unidade de controle baseada em Teensy 3.x
VR1-VR6 VR9 VR10 = 7DI Library:TRIMPOT: Trimming Potentiometer (Trimpot); PROD_ID: ''; SF_SKU: ''; VALUE: TRP
X2 = con-berg:PN61729: BERG USB connector; OC_FARNELL: unknown; OC_NEWARK: unknown

## Net classes
1 GND_HV: width 0.508 mm
2 SIGNAL: width 0.356 mm
3 GND_D: width 0.356 mm
4 +5_D: width 0.356 mm
5 GND_HV1: width 0.508 mm

## Board
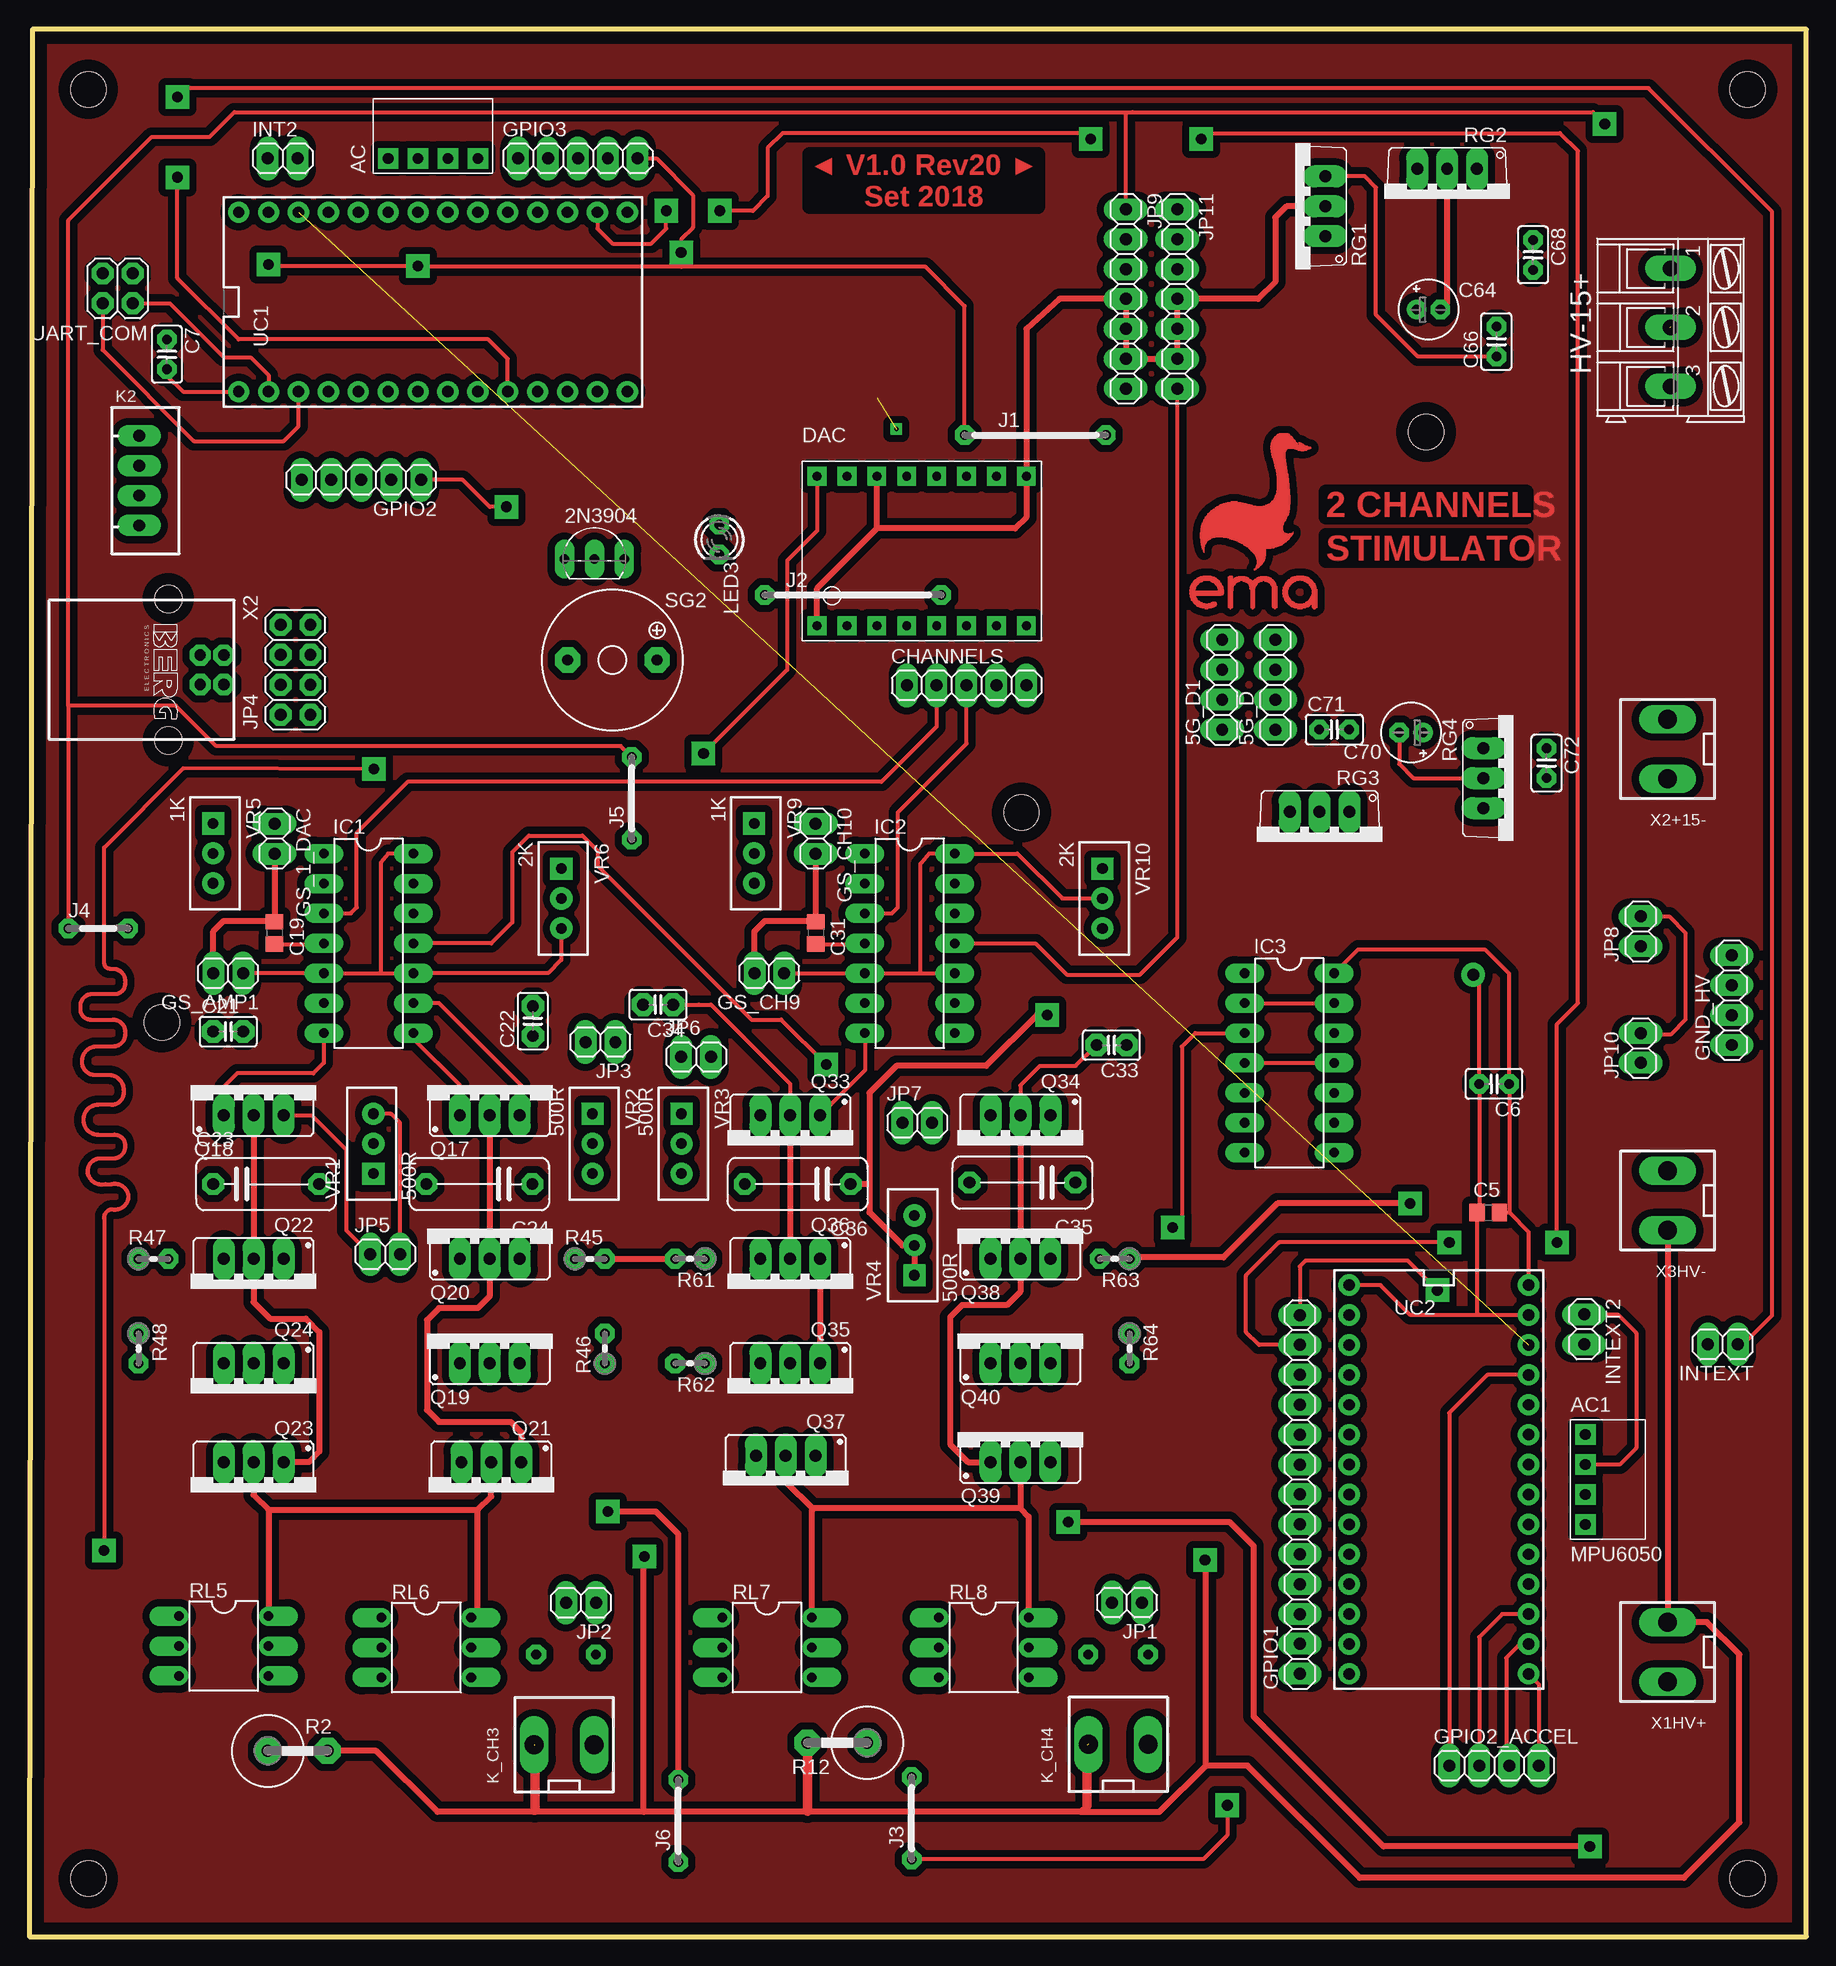
[diagram p5: board, top side]
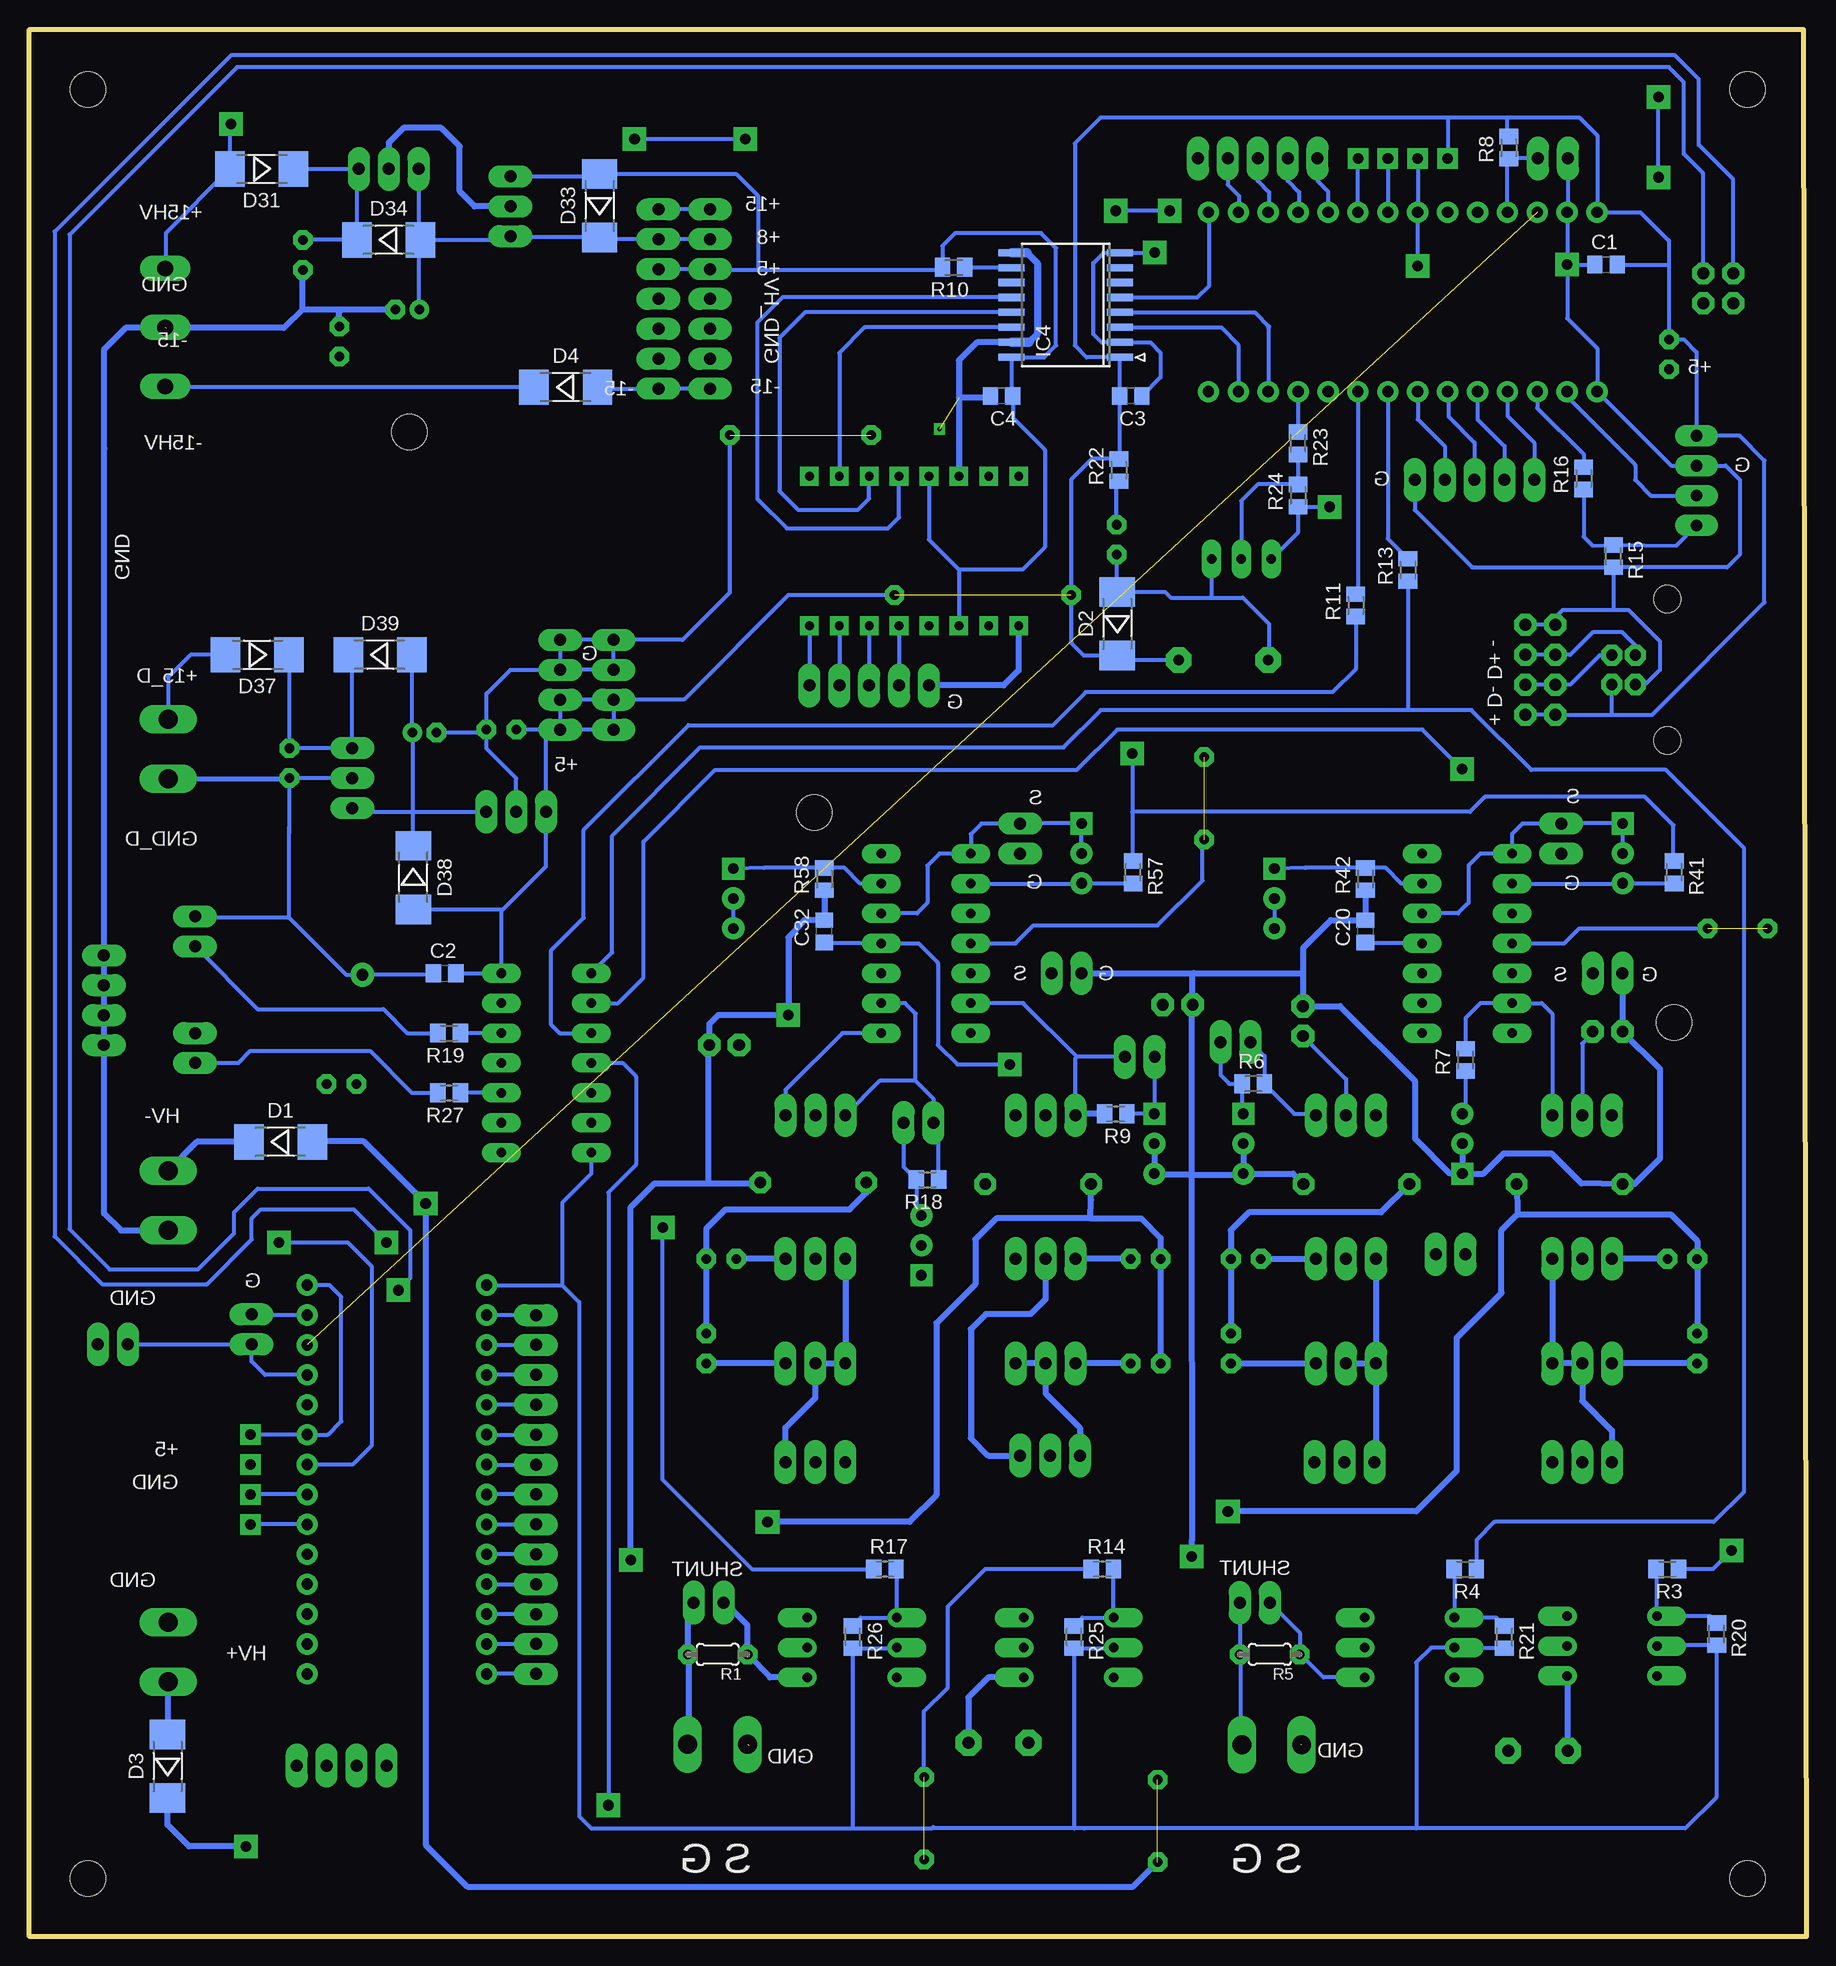
[diagram p6: board, bottom side, seen from below]

Size 150.98 x 162 mm. Coordinates in mm from the lower left corner, seen from the top.
Outline: 0,0 150.98,0 150.98,162 0.25,162 0,0
Copper layers (1*16): Top 0.035mm / dielectric 1.5mm / Bottom 0.035mm
Design rules "default *": minimum track width 6mil, minimum drill 0.35mm, track to track 24mil, track to pad 20mil, pad to pad 20mil, via to via 20mil, smd to smd 6mil, copper to edge 40mil, drill to drill 10mil, minimum pad ring 0.42mm, minimum via ring 0.3mm, stop-mask expansion 4mil, vias tented up to drill 0mil, thermal gap 10mil
Holes 3 mm at 5,4.91 146,4.91 146,156.91 5,156.91 84.29,95.47 118.69,127.81 11.24,77.64

### Footprints (pad centres in the part's own frame; a part is rotated, then mirrored left to right if it is on the bottom)
TO92-EBC = drill 0.813 long: B 0,-1.27; C 2.54,-1.27; E -2.54,-1.27
1X04 = drill 1.016 long: 1 -3.81,0; 2 -1.27,0; 3 1.27,0; 4 3.81,0
MPU6050 = drill 0.9 pad 1.676 square: GND -2.54,0; SCL -2.54,-2.54; SDA -2.54,-5.08; VIN -2.54,2.54
CAP_CER_SMD-0805 = smd 1.3 x 1.5: 1 -0.95,0; 2 0.95,0
C025-025X050 = drill 0.813 octagon: 1 -1.27,0; 2 1.27,0
CAP_CER_2,54-5X5 = drill 1 pad 1.93 octagon: 1 -1.27,0; 2 1.27,0
CAP_CER_16X7 = drill 1 pad 1.676 octagon: 1 -4.5,0; 2 4.5,0
E2-5 = drill 0.813 pad 1.27: + -1.016,0 | drill 0.813 pad 1.27 octagon: - 1.016,0
1X05 = drill 1.016 long: 1 -5.08,0; 2 -2.54,0; 3 0,0; 4 2.54,0; 5 5.08,0
RESM4226X229 = smd 2.5 x 3: AN 2.7,0; CA -2.7,0
DACMOD_P = drill 0.75 square: CH1 1.27,-6.35; CH2 3.81,-6.35; CH3 6.35,-6.35; CH4 8.89,-6.35; CS 3.81,6.35; GND1 -8.89,-6.35; GND2 -3.81,6.35; GND3 8.89,6.35; MOSI 6.35,6.35; NC1 -6.35,-6.35; NC2 -1.27,-6.35; NC3 -6.35,6.35; SCLK 1.27,6.35; VCC1 -3.81,-6.35; VCC2 -1.27,6.35; VREFD -8.89,6.35
1X13 = drill 1.016 long: 1 -15.24,0; 2 -12.7,0; 3 -10.16,0; 4 -7.62,0; 5 -5.08,0; 6 -2.54,0; 7 0,0; 8 2.54,0; 9 5.08,0; 10 7.62,0; 11 10.16,0; 12 12.7,0; 13 15.24,0
1X02 = drill 1.016 long: 1 -1.27,0; 2 1.27,0
PTR_AK300/3 = drill 1.321 long: 1 -5.004,0; 2 0,0; 3 5.004,0
DIL14 = drill 0.813 long: 1 -7.62,-3.81; 2 -5.08,-3.81; 3 -2.54,-3.81; 4 0,-3.81; 5 2.54,-3.81; 6 5.08,-3.81; 7 7.62,-3.81; 8 7.62,3.81; 9 5.08,3.81; 10 2.54,3.81; 11 0,3.81; 12 -2.54,3.81; 13 -5.08,3.81; 14 -7.62,3.81
SO-16DW = smd 0.6 x 2.2: 1 -4.445,-4.6; 2 -3.175,-4.6; 3 -1.905,-4.6; 4 -0.635,-4.6; 5 0.635,-4.6; 6 1.905,-4.6; 7 3.175,-4.6; 8 4.445,-4.6; 9 4.445,4.6; 10 3.175,4.6; 11 1.905,4.6; 12 0.635,4.6; 13 -0.635,4.6; 14 -1.905,4.6; 15 -3.175,4.6; 16 -4.445,4.6
12 = drill 0.813 pad 1.6 octagon: 1 -6,0; 2 6,0
15 = drill 0.813 pad 1.6 octagon: 1 -7.5,0; 2 7.5,0
07 = drill 0.813 pad 1.6 octagon: 1 -3.5,0; 2 3.5,0
05 = drill 0.813 pad 1.6 octagon: 1 -2.54,0; 2 2.54,0
2X04 = drill 1.016 octagon: 1 -3.81,-1.27; 2 -3.81,1.27; 3 -1.27,-1.27; 4 -1.27,1.27; 5 1.27,-1.27; 6 1.27,1.27; 7 3.81,-1.27; 8 3.81,1.27
1X07 = drill 1.016 long: 1 -7.62,0; 2 -5.08,0; 3 -2.54,0; 4 0,0; 5 2.54,0; 6 5.08,0; 7 7.62,0
CONECTOR_BTHC-06 = drill 1 pad 1.676 long: 1 -3.81,0; 2 -1.27,0; 3 1.27,0; 4 3.81,0
CONECTOR_X2_5.08 = drill 1.6 pad 2.184 long: 1 -2.54,0; 2 2.54,0
LED3MM = drill 0.813 octagon: A -1.27,0; K 1.27,0
TO220 = drill 1.016 long: B -2.54,0; C 0,0; E 2.54,0
0204/5 = drill 0.813 pad 1.676 octagon: 1 -2.54,0; 2 2.54,0
0617V = drill 1.016 pad 2.184 octagon: 1 -2.54,0; 2 2.54,0
RESISTENCIA_0805 = smd 1.3 x 1.6: 1 -0.95,0; 2 0.95,0
0204V = drill 0.813 pad 1.676 octagon: 1 -1.27,0; 2 1.27,0
TO220V = drill 1.016 long: 1 -2.54,-2.54; 2 0,-2.54; 3 2.54,-2.54
TS210 = drill 0.813 offset: 1 -2.54,-3.81; 2 0,-3.81; 4 2.54,3.81; 6 -2.54,3.81; NC1 2.54,-3.81; NC2 0,3.81
BUZZER = drill 0.914 pad 2.159 octagon: + 3.8,0; - -3.8,0
2X02 = drill 1.016 octagon: 1 -1.27,-1.27; 2 -1.27,1.27; 3 1.27,-1.27; 4 1.27,1.27
TEENSY_3.0-3.2_DIL = drill 0.965 pad 1.778: 0 -7.62,13.97; 1 -7.62,11.43; 2 -7.62,8.89; 3 -7.62,6.35; 3.3V 7.62,11.43; 4 -7.62,3.81; 5 -7.62,1.27; 6 -7.62,-1.27; 7 -7.62,-3.81; 8 -7.62,-6.35; 9 -7.62,-8.89; 10 -7.62,-11.43; 11 -7.62,-13.97; 12 -7.62,-16.51; 13 7.62,-16.51; 14/A0 7.62,-13.97; 15/A1 7.62,-11.43; 16/A2 7.62,-8.89; 17/A3 7.62,-6.35; 18/A4 7.62,-3.81; 19/A5 7.62,-1.27; 20/A6 7.62,1.27; 21/A7 7.62,3.81; 22/A8 7.62,6.35; 23/A9 7.62,8.89; AGND 7.62,13.97; GND -7.62,16.51; VIN 7.62,16.51
TRIMPOT-PTH-3386U = drill 0.9 pad 1.88 square: 1 -2.54,-0.015 | drill 0.9 pad 1.88: 2 0,-0.015; 3 2.54,-0.015
PN61729 = drill 0.95 octagon: 1 1.25,4.71; 2 -1.25,4.71; 3 -1.25,2.71; 4 1.25,2.71 | hole 2.3: -6.02,0; 6.02,0

### Placement (x,y rotation side)
2N3904  48.01,118.28 0 top
5G_D  105.87,106.34 90 top
5G_D1  101.35,106.34 90 top
AC  33.02,153.58 90 top
AC1  134.75,40.09 0 top
C1  17.02,142.02 0 bottom
C2  115.7,81.83 0 bottom
C3  57.4,130.85 180 bottom
C4  68.38,130.85 180 bottom
C5  123.95,61.51 0 top
C6  124.46,72.43 180 top
C7  11.68,134.4 270 top
C19  20.83,85.25 270 top
C20  37.47,85.38 90 bottom
C21  16.89,76.87 0 top
C22  42.77,77.76 90 top
C23  20.12,63.92 0 top
C24  38.23,63.92 180 top
C31  66.8,85.25 270 top
C32  83.44,85.38 90 bottom
C33  91.95,75.73 180 top
C34  53.42,79.16 180 top
C35  84.38,64.05 180 top
C36  65.28,63.92 180 top
C64  118.87,138.2 0 top
C66  124.65,135.48 90 top
C68  127.76,142.85 270 top
C70  117.41,102.27 180 top
C71  110.87,102.53 0 top
C72  128.91,99.67 270 top
CHANNELS  79.63,106.27 0 top
D1  129.64,67.5 0 bottom
D2  58.55,111.53 90 bottom
D3  139.24,14.47 90 bottom
D4  105.41,131.61 0 bottom
D31  131.25,150.15 180 bottom
D33  102.54,147.03 90 bottom
D34  120.46,144.12 0 bottom
D37  131.62,108.88 180 bottom
D38  118.36,89.95 270 bottom
D39  121.2,108.88 0 bottom
DAC  75.82,117.7 0 top
GND_HV  144.65,79.54 90 top
GPIO1  107.95,37.55 90 top
GPIO2  28.19,123.74 180 top
GPIO2_ACCEL  124.46,14.52 0 top
GPIO3  46.61,151.04 0 top
GS_1_DAC  20.83,93.26 270 top
GS_AMP1  16.89,81.83 180 top
GS_CH9  62.87,81.83 180 top
GS_CH10  66.8,93.26 270 top
HV-15+  139.45,136.69 270 top
IC1  28.83,84.37 270 top
IC2  74.8,84.37 270 top
IC3  107.06,74.21 270 top
IC4  62.93,138.59 90 bottom
INT2  21.53,151.04 0 top
INTEXT  143.89,50.3 180 top
INTEXT2  132.11,51.57 270 top
J1  85.47,127.55 0 top
J2  69.98,113.96 0 top
J3  74.96,10.05 90 top
J4  5.84,85.64 0 top
J5  51.18,96.69 90 top
J6  55.12,9.82 90 top
JP1  93.27,28.37 180 top
JP2  46.86,28.35 180 top
JP3  48.51,75.98 180 top
JP4  22.61,107.61 90 top
JP5  30.23,57.95 0 top
JP6  56.64,74.71 0 top
JP7  75.44,69.13 0 top
JP8  136.91,85.38 90 top
JP9  93.15,139.1 270 top
JP10  136.91,75.48 90 top
JP11  97.54,139.1 270 top
K2  9.33,123.67 270 top
K_CH3  45.43,16.29 0 top
K_CH4  92.52,16.32 0 top
LED3  58.61,118.66 270 top
Q17  39.12,69.76 0 top
Q18  19.05,69.76 0 top
Q19  39.12,48.68 0 top
Q20  39.12,57.57 0 top
Q21  39.24,40.3 180 top
Q22  19.05,57.57 180 top
Q23  19.05,40.3 180 top
Q24  19.05,48.68 180 top
Q33  64.64,69.76 180 top
Q34  84.2,69.76 180 top
Q35  64.64,48.68 180 top
Q36  64.64,57.57 180 top
Q37  64.26,40.86 180 top
Q38  84.2,57.57 0 top
Q39  84.2,40.3 0 top
Q40  84.2,48.68 0 top
R1  92.51,23.96 180 bottom
R2  22.8,15.77 0 top
R3  11.81,31.22 180 bottom
R4  28.98,31.22 180 bottom
R5  45.59,23.96 180 bottom
R6  46.99,72.43 0 bottom
R7  28.96,74.46 90 bottom
R8  25.29,151.96 90 bottom
R9  58.67,69.89 180 bottom
R10  72.45,141.79 180 bottom
R11  38.29,113.07 90 bottom
R12  68.64,16.46 180 top
R13  33.85,116.08 90 bottom
R14  59.82,31.22 0 bottom
R15  16.38,117.26 270 bottom
R16  18.92,123.86 90 bottom
R17  78.3,31.22 0 bottom
R18  74.68,64.3 180 bottom
R19  115.32,76.75 180 bottom
R20  7.62,25.69 270 bottom
R21  25.65,25.44 270 bottom
R22  58.42,124.56 90 bottom
R23  43.18,126.85 270 bottom
R24  43.18,122.4 90 bottom
R25  62.23,25.44 270 bottom
R26  81.03,25.44 270 bottom
R27  115.32,71.67 180 bottom
R41  11.23,90.41 270 bottom
R42  37.47,89.83 90 bottom
R45  47.62,57.57 0 top
R46  48.9,49.95 90 top
R47  10.54,57.57 0 top
R48  9.27,49.95 270 top
R57  57.2,90.41 270 bottom
R58  83.44,89.83 90 bottom
R61  56.13,57.57 180 top
R62  56.13,48.68 180 top
R63  92.2,57.57 180 top
R64  93.47,49.95 270 top
RG1  107.57,146.98 90 top
RG2  120.46,147.61 180 top
RG3  109.62,93 180 top
RG4  126.09,98.4 270 top
RL5  16.51,24.68 270 top
RL6  33.72,24.55 270 top
RL7  62.67,24.55 270 top
RL8  81.09,24.55 270 top
SG2  49.53,108.43 0 top
UART_COM  7.49,140 180 top
UC1  34.29,138.85 90 top
UC2  119.76,38.82 0 top
VR1  29.21,67.35 90 top
VR2  47.85,67.35 270 top
VR3  55.42,67.35 270 top
VR4  75.18,58.71 90 top
VR5  15.62,92.01 270 top
VR6  45.21,88.18 270 top
VR9  61.59,92.01 270 top
VR10  91.19,88.18 270 top
X1HV+  139.19,24.17 90 top
X2  11.81,107.61 270 top
X2+15-  139.19,100.88 90 top
X3HV-  139.19,62.52 90 top

### Tracks (layer width: path | path; a pad name or v marks a point on that pad's centre or on a via)
1HV+
  Bottom 0.508: D3.AN 139.19,17.22 X1HV+.1
1HV-
  Bottom 0.508: D1.CA 136.75,67.5 X3HV-.2
3.3V  (1 unrouted)
!SYNC
  Bottom 0.356: IC4.4 46.86,137.96 45.66,136.75 45.72,136.69 UC1.10
!SYNC_ISO
  Bottom 0.356: IC4.13 85.09,137.96 87.25,135.8 87.25,122.78 85.66,121.2 80.58,121.2 79.63,122.15 DAC.CS
+5_D  (1 unrouted)
  Top 0.356: IC3.14 112.9,83.86 123.65,83.86 125.73,81.78 C6.1 125.73,61.51 | C5.2 125.73,61.51 | 125.73,61.51 127.38,59.86 UC2.VIN
  Bottom 0.356: 58.54,107.92 D2.CA | 30.42,154.53 59.94,154.53 62.17,152.31 62.17,135.17 61.15,134.15 IC4.1 58.35,134.12 C3.2 58.35,125.58 R22.2 60.71,125.51 62.48,123.74 J2.1 | 30.42,154.53 25.4,154.53 | 25.4,154.53 19.3,154.53 17.78,153.01 UC1.VIN 14.1,146.47 11.68,144.06 11.68,142.02 | AC.VIN 30.42,151.1 30.42,154.53 | D38.AN 110.74,87.25 | 110.74,87.25 110.87,87.13 IC3.14 C2.2 | 110.74,87.25 107.08,90.91 RG3.3 107.08,102.42 107.19,102.53 | J2.1 | J2.1 62.48,109.91 61.41,108.83 D2.CA | J2.2 86.49,113.96 95.38,105.07 5G_D1.2 | UC2.VIN 125.48,55.33 124.48,54.34 124.48,43.75 125.6,42.63 UC2.21/A7 AC1.VIN | JP4.1 JP4.2 16.52,103.8 | 16.52,103.8 X2.1 | 16.52,103.8 13.08,103.8 3.56,113.32 3.56,125.36 5.68,127.48 K2.1 9.34,134.59 10.41,135.67 C7.1 11.68,142.02 | 5G_D.1 5G_D.2 5G_D1.2 | 107.44,102.53 C71.1 | R8.2 25.4,153.02 25.4,154.53 | 107.08,102.17 107.44,102.53 | 5G_D.1 107.19,102.53 | 107.19,102.53 107.44,102.53 | SG2.+ 58.15,108.43 D2.CA | 5G_D1.2 5G_D1.1 5G_D.1 | C1.2 11.68,142.02
+5_HV
  Top 0.356: C66.1 117.98,134.21 114.43,137.77 114.43,148.56 113.47,149.52 RG1.3
  Bottom 0.356: DAC.VCC2 74.55,118.66 72.01,116.12 | 72.01,116.12 DAC.VCC1 | 72.01,116.12 66.61,116.12 64.71,118.02 64.71,126.28 67.43,129 C4.1 67.53,130.95 IC4.16 64.77,134.15 63.75,135.17 63.75,143.42 65.02,144.69 72.33,144.69 73.4,143.61 R10.2 73.62,141.58 89.09,141.58 | RG1.3 102.9,149.52 D33.AN 90.95,149.73 89.09,147.87 89.09,141.58 | 89.09,141.58 93.6,141.58 JP9.3 JP11.3
+8_D
  Bottom 0.356: RG4.3 122.24,95.54 118.36,95.54 | 118.36,95.54 RG3.1 | D38.CA 118.36,95.54 | 118.48,108.86 D39.AN 118.5,102.34 C70.+ 118.43,95.61 118.36,95.54
+8_HV
  Bottom 0.356: RG2.3 117.92,144.28 117.86,144.22 | 117.86,144.22 D34.AN 110.93,144.12 RG1.1 110,144.33 D33.CA 102.87,144.28 102.77,144.18 JP11.2 JP9.2 | C64.+ 117.86,144.22
+15_HV  (via drill 0.9 pad 2)  (2 unrouted)
  Top 0.356: C19.2 24.96,84.31 IC1.4 | C31.2 70.93,84.31 IC2.4 | 3.3,104.56 J4.1 | J5.2 50.24,101.13 15.87,101.13 12.45,104.56 3.3,104.56 | 3.3,104.56 3.3,145.78 10.4,152.88 15.31,152.88 17.41,154.98 93.73,154.98 | 93.73,154.98 93.16,154.91 JP9.1 | v133.86,153.96 132.84,154.98 93.73,154.98
  Bottom 0.356: IC2.4 67.18,84.37 65.66,85.89 55.12,85.89 51.31,89.7 51.31,93.06 J5.1 | IC1.4 20.57,84.37 19.3,85.64 J4.2 | 139.38,141.64 139.38,144.72 D31.AN 133.95,153.87 v133.86,153.96 | JP9.1 JP11.1
  Bottom 0.508: HV-15+.1 139.38,141.64
-15
  Bottom 0.356: D4.CA 138.94,131.61 139.36,131.61 139.37,131.61 HV-15+.3
-15_HV  (via drill 0.9 pad 2)
  Top 0.356: IC2.11 85.47,84.37 88.14,81.7 94.36,81.7 97.54,84.87 JP11.7 | v67.69,74.08 63.88,77.89 61.34,77.89 48.26,90.97 48.26,92.24 46.99,93.51 42.42,93.51 41.02,92.11 41.02,86.14 39.24,84.37 IC1.11
  Bottom 0.356: IC1.11 37.4,84.37 C20.1 | C32.1 83.37,84.37 IC2.11 75.44,84.37 73.79,82.72 73.79,75.73 72.14,74.08 v67.69,74.08 | D4.AN 102.58,131.48 JP11.7 JP9.7
C_15D
  Bottom 0.356: GPIO1.11 UC2.2
C_CH1
  Bottom 0.356: 33.78,104.18 59.94,104.18 63.12,101 93.98,101 101.47,93.51 101.47,83.6 IC3.1 | 33.78,104.18 33.84,104.24 R13.1 | 33.78,104.18 28.45,104.18 23.37,99.1 11.94,99.1 5.33,92.49 5.33,37.76 7.87,35.22 26.49,35.22 28.03,33.68 R4.1
C_CH1N  (via drill 0.9 pad 2)
  Top 0.356: v29.26,99.17 13.08,99.22 6.35,92.49 6.35,82.72 arc90 6.86,82.21 7.11,82.21 arc-90 8.13,81.19 8.13,80.94 arc-90 7.24,80.05 5.33,80.05 arc90 4.32,79.03 4.32,78.78 arc90 5.21,77.89 7.11,77.89 arc-90 8.13,76.87 8.13,76.62 arc-90 7.11,75.6 5.71,75.6 arc90 4.45,74.33 arc90 5.59,73.19 6.73,73.19 arc-90 8,71.92 8,71.67 arc-90 6.98,70.65 5.84,70.65 arc90 4.57,69.38 arc90 5.84,68.11 7.24,68.11 arc-90 8.13,67.22 8.13,67.09 arc-90 7.11,66.08 5.84,66.08 arc90 4.95,64.81 arc90 6.48,63.92 6.98,63.92 arc-90 8.38,63.03 8.38,62.65 arc-90 6.98,61.76 arc90 6.35,61 v6.35,32.8 | IC3.2 IC3.13
  Bottom 0.356: IC3.2 100.96,79.29 98.81,81.44 98.81,93 92.71,99.1 61.98,99.1 58.55,102.53 32.61,102.53 v29.26,99.17 | v6.35,32.8 7.94,31.22 R3.1
C_CH2  (via drill 0.9 pad 2)
  Top 0.356: IC3.3 99.06,76.75 97.92,75.6 97.92,60.84 97.31,60.24 v97.16,60.24
  Bottom 0.356: R11.1 38.29,107.67 40.26,105.7 61.21,105.7 64.01,102.91 95,102.91 103.89,94.02 103.89,86.53 106.68,83.73 106.68,77.51 105.92,76.75 IC3.3 | R17.1 89.6,31.22 97.22,38.84 97.22,60.17 v97.16,60.24
C_CH2N  (via drill 0.9 pad 2)  (1 unrouted)
  Top 0.356: v101.79,11.15 101.79,8.61 99.75,6.57 J3.1 | IC3.4 IC3.11
  Bottom 0.356: IC3.4 100.58,74.21 99.44,73.06 99.44,65.57 101.79,63.22 v101.79,11.15 | R14.1 69.79,31.22 72.95,28.05 72.95,21.14 74.95,19.14 J3.2
CH1
  Top 0.356: IC1.3 27.3,86.91 27.81,87.41 27.81,93.76 32.13,98.08 72.39,98.08 77.09,102.78 CHANNELS.2
  Bottom 0.356: DAC.CH1 CHANNELS.2
CH2
  Top 0.356: IC2.3 73.28,86.91 73.79,87.41 73.79,95.49 79.63,101.33 CHANNELS.3
  Bottom 0.356: DAC.CH2 CHANNELS.3
CH3
  Bottom 0.356: DAC.CH3 CHANNELS.4
CH4
  Bottom 0.356: DAC.CH4 CHANNELS.5
D+
  Bottom 0.356: X2.3 14.52,109.68 15.62,110.78 18.16,110.78 20.07,108.88 JP4.6 JP4.5
D-
  Bottom 0.356: X2.2 17.55,108.86 20.07,106.34 JP4.4 JP4.3
DIN
  Bottom 0.356: IC4.3 49.72,136.69 48.26,135.23 UC1.11
DIN_ISO
  Bottom 0.356: IC4.14 80.01,136.69 82.17,134.53 DAC.MOSI
GND_D  (via drill 0.9 pad 2, 1 pad 2)  (1 unrouted)
  Top 0.356: GPIO3.5 53.28,151.04 56.39,147.93 56.39,145.17 55.37,144.16 v55.37,143.04 55.37,141.83 | RG4.2 117.6,98.4 116.4,99.61 C70.- | J1.1 79.47,138.5 76.14,141.83 55.37,141.83 | UC2.AGND 123.19,52.79 | 123.19,52.79 117.35,52.79 114.81,55.33 UC2.GND | AC1.GND 135.13,40.09 136.53,41.49 136.53,51.27 134.95,52.84 INTEXT2.1 | v40.51,121.45 39.12,121.45 36.83,123.74 GPIO2.1 | C5.1 123,61.25 | 123,61.25 123,52.98 123.19,52.79 | UC1.GND 13.05,131.23 11.68,132.6 C7.2 | v20.32,142.02 20.45,141.9 v33.02,141.9 33.08,141.83 55.37,141.83 | 123,61.25 123.19,61.44 C6.2 123.19,81.19 v122.68,81.7 | JP8.2 139.32,86.65 140.72,85.25 140.72,77.89 139.45,76.62 137.03,76.62 JP10.2
  Bottom 0.356: AC.GND UC1.20/A6 v33.02,141.9 | GPIO2.1 33.27,121.2 28.39,116.31 R15.2 | R15.2 6.73,116.31 5.65,117.39 5.65,123.74 6.86,124.94 K2.2 11.49,124.94 UC1.GND 17.78,134.91 20.32,137.45 v20.32,142.02 | C70.- 112.39,102.27 C71.2 | RG4.2 C72.2 128.91,98.34 128.91,93.76 128.92,94.21 128.92,86.54 | J1.2 91.47,114.18 95.5,110.15 5G_D1.4 | 33.15,9.18 10.29,9.18 7.62,11.85 R20.2 12.63,24.74 RL5.2 | 33.15,9.18 61.37,9.18 | 61.37,9.18 62.23,9.18 | 62.23,9.18 74.3,9.18 | 81.03,9.18 103.25,9.18 104.27,10.2 104.27,53.89 105.71,55.33 | 81.03,9.18 74.3,9.18 | 33.15,9.18 33.15,23.28 31.88,24.55 RL6.2 29.85,24.49 R21.2 | 74.17,9.31 74.3,9.18 | C2.1 116.65,81.7 v122.68,81.7 124.08,81.7 128.92,86.54 | 5G_D.3 5G_D.4 5G_D1.4 | IC3.7 103.25,64.81 105.71,62.34 105.71,55.33 | 2N3904.E 43.18,119.29 R24.1 v40.51,121.45 | C71.2 112.14,105.57 110.11,107.61 5G_D.3 | 61.34,9.21 61.37,9.18 | UC2.AGND 132.06,52.79 INTEXT2.1 | JP4.7 JP4.8 21.34,112.05 20.7,112.69 16.26,112.69 | RG3.2 109.62,98.39 112.14,100.9 C71.2 | INT2.1 20.26,146.53 UC1.AGND v20.32,142.02 | 62.23,9.18 R25.2 58.93,24.49 RL7.2 | 81.03,9.18 R26.2 77.34,24.49 RL8.2 | UC2.GND 105.71,55.33 | 16.26,112.69 15.11,112.69 12.45,110.02 12.45,107.61 13.72,106.34 14.5,106.34 X2.4 | R15.2 16.38,112.81 16.26,112.69 | JP8.2 137.03,86.52 137.01,86.54 128.92,86.54 | 5G_D1.4 5G_D1.3 5G_D.3 | v20.32,142.02 C1.1 | C3.1 54.86,132.44 54.86,134.53 55.75,135.42 IC4.2 59.88,135.42 60.58,136.12 60.58,142.15 59.69,143.04 IC4.8 v55.37,143.04
  Bottom 0.406: X2+15-.1 128.91,98.34
GND_HV  (via drill 0.35, 0.9 pad 2)  (4 unrouted)
  Top 0.508: DAC.GND1 66.93,114.53 72.01,119.61 | 72.01,119.61 DAC.GND2 | 72.01,119.61 83.76,119.61 84.71,120.56 DAC.GND3 84.71,136.56 87.5,139.1 JP9.4 JP9.5 JP9.6 JP11.6 JP11.5 JP11.4 104.39,139.1 105.85,140.56 105.85,146.02 106.81,146.98 RG1.2 | GS_1_DAC.2 C19.1 20.76,86.27 16.51,86.27 15.62,85.38 GS_AMP1.2 | GS_CH10.2 C31.1 66.74,86.27 62.48,86.27 61.59,85.38 GS_CH9.2 | RG2.2 120.46,138.78 C64.- | 52.2,10.58 42.82,10.58 | 42.82,10.58 34.67,10.58 29.48,15.77 R2.2 | 52.23,10.62 52.2,10.58 | v86.49,78.27 85.6,78.27 81.28,73.95 73.66,73.95 71.37,71.67 71.37,63.92 | 89.31,10.58 66.04,10.58 | 66.04,10.58 52.2,10.58 | 52.2,10.58 52.2,32.26 v52.23,32.3 | 99.95,14.52 103.5,14.52 113.03,4.99 140.59,4.99 145.29,9.69 145.29,23.97 142.55,26.71 X1HV+.2 X3HV-.1 | 99.95,14.52 99.95,31.92 v99.88,31.98 | 66.1,10.64 66.04,10.58 | 42.96,10.72 42.82,10.58 | 89.85,11.12 89.31,10.58 | 99.95,14.52 96.01,10.58 89.31,10.58 | 71.37,63.92 C36.1 | VR4.1 VR4.2 74.17,58.71 71.37,61.51 71.37,63.92
  Top 0.813: R12.2 66.1,10.64 | 42.96,16.29 42.96,10.72 | 89.85,16.27 89.85,11.12
  Bottom 0.508: IC4.15 70.48,135.42 72.01,133.9 72.01,130.72 | 72.01,130.72 DAC.GND2 | C4.2 69.46,130.72 72.01,130.72 | DAC.GND1 66.93,107.54 68.2,106.27 CHANNELS.1 | R42.1 C20.2 40.4,86.33 42.75,83.98 42.75,81.83 | GS_AMP1.2 C21.1 12.45,73.7 12.45,66.08 14.61,63.92 C23.1 19.1,63.97 21.67,66.53 25.7,66.53 27.43,64.81 VR1.1 | R58.1 C32.2 85.16,86.33 85.98,85.38 86.49,84.87 v86.49,78.27 92.46,78.27 93.22,77.51 C33.1 93.27,75.68 93.27,63.97 | RG1.2 113.16,146.98 114.43,148.25 114.43,152.06 116.02,153.64 119.19,153.64 120.46,152.38 RG2.2 | 99.95,32.04 v99.88,31.98 99.88,61.95 97.87,63.97 93.27,63.97 | v52.23,32.3 52.23,33.66 52.2,33.69 52.25,63.94 52.25,64.55 | 144.65,126.4 144.62,126.37 144.59,126.39 | 144.65,126.4 GND_HV.4 GND_HV.3 GND_HV.2 GND_HV.1 144.65,61.43 143.21,59.98 X3HV-.1 | C35.1 88.95,63.97 93.27,63.97 | 127.76,138.24 C68.2 | 52.25,64.55 52.25,79.06 C34.2 52.15,81.75 52.07,81.83 | 52.25,64.55 52.4,64.71 55.31,64.71 VR3.3 VR3.2 | VR2.3 43.62,64.81 C24.1 | 52.25,64.55 52.09,64.71 47.94,64.71 VR2.3 | VR1.1 30.28,64.81 33.24,67.77 33.24,72.65 39.62,79.03 C22.2 42.75,80.4 42.75,81.83 | 144.65,126.4 144.65,134.78 142.8,136.64 139.38,136.64 129.36,136.64 127.76,138.24 | VR2.2 VR2.3 | VR1.2 VR1.1 | GS_CH9.2 52.07,81.83 | 52.07,81.83 42.75,81.83 | C64.- 124.46,138.2 | 124.46,138.2 127.73,138.2 127.76,138.24 | C66.2 124.65,138.01 124.46,138.2
  Bottom 0.61: 66.23,143.04 65.34,142.15 65.34,136.12 66.04,135.42
  Bottom 0.813: IC4.9 66.23,143.04 | 66.04,135.42 IC4.15
  other vias: 73.66,128.05
  cutout Bottom: 0.98,161 149.98,161 149.98,1 0.98,1
GPIO1
  Bottom 0.356: UC1.2 25.4,129.2 23.11,126.91 GPIO2.5
GPIO2
  Bottom 0.356: UC1.3 27.94,128.88 25.65,126.59 GPIO2.4
GPIO3
  Bottom 0.356: UC1.4 30.42,131.17 30.42,129.13 28.19,126.91 GPIO2.3
GPIO4
  Bottom 0.356: UC1.5 33.02,128.88 30.73,126.59 GPIO2.2
GPIO5  (via drill 0.9 pad 2)
  Top 0.356: UC1.14/A0 48.26,145.07 49.53,143.8 52.83,143.8 54.1,145.07 v54.1,146.6 | v58.67,146.6 61.47,146.6 62.74,147.87 62.74,151.93 64.01,153.2 89.66,153.2 v90.17,152.69 | v129.79,58.97 129.79,77.51 131.57,79.29 131.57,151.68 130.05,153.2 100.08,153.2 v99.57,152.69
  Bottom 0.356: GPIO3.4 49.15,148.82 48.2,147.87 48.2,146.53 UC1.14/A0 | v54.1,146.6 v58.67,146.6 | v90.17,152.69 v99.57,152.69 | UC2.20/A6 123.52,40.09 121.92,41.69 121.92,56.93 123.95,58.97 v129.79,58.97
GPIO6
  Bottom 0.356: GPIO3.3 46.61,149.14 45.66,148.18 45.66,146.53 UC1.15/A1
GPIO7
  Bottom 0.356: GPIO3.2 44.07,149.14 43.12,148.18 43.12,146.53 UC1.16/A2
GPIO8
  Bottom 0.356: GPIO3.1 41.53,149.14 40.64,148.25 UC1.17/A3
GS_CH1
  Top 0.356: IC1.14 30.48,91.99 29.84,91.22 29.84,81.83 | 29.84,81.83 IC1.10 44.07,81.83 45.2,82.95 VR6.3 | 29.84,81.83 IC1.5 GS_AMP1.1
  Bottom 0.356: VR6.2 VR6.3
GS_CH2
  Top 0.356: 75.69,81.83 IC2.5 GS_CH9.1 | 75.69,81.83 IC2.10 | 75.69,81.83 75.69,91.1 75.82,91.22 76.45,91.99 IC2.14 83.95,91.99 87.76,88.18 VR10.2
  Bottom 0.356: VR10.3 VR10.2
HV+  (via drill 0.9 pad 2)
  Top 0.508: R45.2 R61.2 | v88.27,35.22 101.98,35.22 104.01,33.19 104.01,18.71 115.06,7.66 v132.59,7.66
  Bottom 0.508: C24.2 36.14,61.51 47.37,61.51 48.9,59.98 R45.2 R46.2 | 60.83,61 68.83,61 70.61,59.22 70.61,55.41 73.91,52.11 73.91,37.5 76.2,35.22 v88.27,35.22 | C36.2 60.78,62.58 60.83,61 | 60.83,61 56.52,61 54.86,59.35 R61.2 R62.2 | v132.59,7.66 137.41,7.66 139.24,9.49 D3.CA
HV-  (via drill 0.9 pad 2)  (1 unrouted)
  Top 0.356: 93.6,57.7 R63.1
  Top 0.508: v49.15,36.11 53.21,36.11 55.12,34.2 J6.2 | 93.6,57.7 101.47,57.7 106.05,62.27 v117.32,62.27
  Bottom 0.356: v117.32,62.27 117.32,61.73
  Bottom 0.508: R48.1 R47.1 9.27,59.09 11.53,61.35 24.55,61.35 | C23.2 24.55,61.35 | v49.15,36.11 33.15,36.11 29.72,39.53 29.72,50.84 25.91,54.65 25.91,59.99 24.55,61.35 | J6.1 57.21,4.23 113.79,4.23 117.32,7.76 v117.32,62.27 122.6,67.55 126.89,67.55 D1.AN | C35.2 79.88,63.16 81.28,61.76 91.82,61.76 93.47,60.11 R63.1 R64.1
N$1
  Top 0.356: UC2.23/A9 123.88,47.71 120.65,44.49 GPIO2_ACCEL.1
  Bottom 0.356: UC2.23/A9 130.96,47.71 132.11,48.86 INTEXT2.2 INTEXT.2
N$2
  Bottom 0.356: R3.2 12.7,31.16 RL5.1 8.19,27.22 R20.1
N$3
  Bottom 0.356: R4.2 29.91,31.21 RL6.1 26.35,27.09 R21.1
N$4
  Bottom 0.508: RL5.4 20.32,15.84 R2.1
N$5  (via drill 0.9 pad 2)
  Top 0.356: UC1.8 40.64,134.02 38.99,135.67 17.78,135.67 12.57,140.88 12.57,148.43 v12.57,149.44 | v12.57,156.25 13.34,157.01 137.57,157.01 148.08,146.5 148.08,52.77 145.62,50.31 INTEXT.1
  Bottom 0.356: v12.57,149.44 v12.57,156.25
N$6  (via drill 0.9 pad 2)
  Top 0.356: GPIO1.13 107.95,56.93 108.46,57.44 117.09,57.44 v119.63,54.9
  Bottom 0.356: GPIO1.13 UC2.0 | UART_COM.1 8.76,149.77 10.41,151.42 10.41,157.52 11.68,158.79 133.35,158.79 147.57,144.56 147.57,60.08 144.17,56.68 136.65,56.68 133.6,59.73 133.6,61.51 131.57,63.54 122.17,63.54 118.62,59.98 118.62,55.92 v119.63,54.9
N$7  (via drill 0.9 pad 2)
  Top 0.356: GPIO1.12 104.47,50.25 103.38,51.35 103.38,56.17 105.41,58.2 106.17,58.97 v120.65,58.97
  Bottom 0.356: UC2.1 GPIO1.12 | UART_COM.3 6.22,149.26 9.14,152.18 9.14,157.77 11.18,159.8 133.86,159.8 148.84,144.82 148.84,59.47 144.78,55.41 135.89,55.41 132.08,59.22 132.08,61 131.32,61.76 123.44,61.76 v120.65,58.97
N$8
  Bottom 0.356: RL6.4 41.02,22.01 42.98,23.97 R5.1 43.05,25.81 JP2.2
N$9
  Bottom 0.356: D37.AN 137.29,108.88 139.19,106.97 X2+15-.2
N$10
  Bottom 0.356: GPIO1.10 UC2.3
N$11
  Bottom 0.356: UC2.4 GPIO1.9
N$12
  Bottom 0.356: UC2.5 GPIO1.8
N$13
  Bottom 0.356: R14.2 RL7.1 61.53,27.09 R25.1
N$14
  Bottom 0.356: GPIO1.7 UC2.6
N$15
  Bottom 0.356: UC2.7 GPIO1.6
N$16
  Bottom 0.356: R17.2 77.28,31.15 RL8.1 80.32,27.09 R26.1
N$17
  Bottom 0.508: RL7.4 69.49,22.01 71.2,20.31 71.2,16.47 R12.1
N$18
  Bottom 0.356: JP2.1 R5.2 48.04,23.88 48.04,16.29
  Bottom 0.508: K_CH3.2 48.04,16.29
N$19
  Bottom 0.356: GPIO1.5 UC2.8
N$20
  Bottom 0.356: UC2.9 GPIO1.4
N$21
  Bottom 0.356: GPIO1.3 UC2.10
N$22
  Bottom 0.356: UC2.11 GPIO1.2
N$23
  Bottom 0.356: GPIO1.1 UC2.12
N$24
  Top 0.356: VR1.3 30.73,69.89 31.5,69.13 JP5.2
  Bottom 0.356: R7.1 28.96,70.16 VR1.3
N$25
  Bottom 0.356: R1.2 94.93,23.85
  Bottom 0.508: R1.2 95.05,27.86 JP1.1 | 94.93,23.85 94.93,16.27 94.98,16.32 K_CH4.2
N$26
  Bottom 0.508: RL8.4 88.06,22.01 R1.1 89.97,26.45 91.87,28.36 JP1.2
N$27
  Bottom 0.356: JP3.1 49.78,73.19 49.02,72.43 R6.1 47.94,69.99 VR2.1
N$28
  Bottom 0.356: 61.98,69.89 Q33.E 62.1,74.59 61.98,74.71 | JP6.2 61.98,74.71 | 61.98,74.71 66.55,79.29 IC2.6
  Bottom 0.508: R9.2 61.98,69.89
N$29
  Bottom 0.356: R9.1 VR3.1 55.41,74.68 JP6.1
N$30
  Bottom 0.356: JP7.2 76.71,65.38 R18.2 75.63,61.68 VR4.3
N$31
  Bottom 0.356: IC2.9 76.58,79.29 75.69,78.4 75.69,72.68 | R18.1 73.73,68.68 JP7.1 74.17,71.16 75.69,72.68 | 75.69,72.68 78.74,72.68 Q34.E
N$32
  Bottom 0.356: JP8.1 131.57,78.78 120.9,78.78 118.87,76.75 R19.2
N$33
  Bottom 0.356: IC3.12 R19.1
N$34
  Bottom 0.356: IC3.10 R27.1
N$35
  Bottom 0.356: JP10.1 133.22,74.21 132.21,75.22 122.05,75.22 118.49,71.67 R27.2
N$36
  Top 0.356: UART_COM.4 6.22,134.79 13.97,127.04 21.59,127.04 22.86,128.31 UC1.1
  Bottom 0.356: UC1.1 22.86,129.83 18.92,125.9 R16.2
N$37
  Top 0.356: UC2.13 128.27,21.42 GPIO2_ACCEL.4
N$38
  Top 0.356: UART_COM.2 11.93,138.73 16.51,134.15 18.8,134.15 20.32,132.63 UC1.0
  Bottom 0.356: UC1.0 20.32,130.78 14.54,125.01 14.54,123.74 13.21,122.4 K2.3
N$39
  Top 0.356: UC2.14/A0 126.67,24.85 125.48,23.66 125.48,14.77 GPIO2_ACCEL.3
N$40
  Top 0.356: UC2.15/A1 125.15,27.39 123.19,25.44 GPIO2_ACCEL.2
N$41
  pour Top: 0.98,161 149.98,161 149.98,1 145.98,1 0.98,1 0.98,8
N$66
  Bottom 0.356: IC4.10 71.48,141.77 R10.1
N$69
  Bottom 0.356: R16.1 18.92,118.91 18.16,118.15 R15.1 11.05,118.15 K2.4
N$72
  Bottom 0.356: LED3.A 58.61,123.42 R22.1
N$73
  Bottom 0.356: SG2.- 45.66,108.51 45.66,111.51 47.88,113.74 50.67,113.74 | LED3.K 58.61,114.29 D2.AN 54.5,114.23 54.01,113.74 50.67,113.74 | 2N3904.C 50.55,113.86 50.67,113.74
N$74
  Bottom 0.356: R23.2 R24.2 46.61,123.35 48.01,121.96 2N3904.B
N$75
  Bottom 0.356: INT2.2 25.25,151.04 R8.1 25.4,150.89 UC1.23/A9
N$106
  Bottom 0.356: IC1.2 15.63,89.45 VR5.3 11.24,89.47 R41.2
N$107
  Bottom 0.356: IC1.12 29.59,86.91 28.7,87.79 28.7,90.97 27.69,91.99 IC1.1 25.02,93.64 24.13,94.53 GS_1_DAC.1 20.8,94.55 VR5.1 VR5.2
N$108
  Bottom 0.356: IC1.13 34.42,89.45 35.75,90.78 R42.2 42.59,90.78 VR6.1
N$109
  Top 0.356: Q17.E 41.78,69.89 41.78,72.3 34.8,79.29 IC1.9
  Bottom 0.356: Q17.E 41.78,69.89 43.5,69.89 R6.2 46.04,74.78 JP3.2
N$110
  Top 0.356: Q18.E 24,69.76 26.92,66.84 26.92,59.98 JP5.1
  Bottom 0.356: Q18.E 21.59,78.4 22.48,79.29 IC1.6 27.69,79.29 28.96,78.02 R7.2
N$111
  Top 0.508: Q18.C Q22.C 19.05,53.89 20.45,52.49 23.49,52.49 24.64,51.35 24.64,41.19 23.75,40.3 Q23.B
  Bottom 0.356: C21.2 18.16,76.75 19.05,75.86 Q18.C
N$112
  Top 0.508: Q17.C Q20.C 39.12,54.39 38.1,53.38 34.8,53.38 33.78,52.36 33.78,44.74 34.8,43.73 40.89,43.73 41.78,42.84 Q21.B
  Bottom 0.356: Q17.C 39.12,72.83 42.01,75.73 C22.1
N$113
  Bottom 0.508: R45.1 Q20.E
N$114
  Bottom 0.508: R46.1 Q19.E
N$115
  Bottom 0.508: Q20.B Q19.B | Q19.C Q19.B | Q19.B 36.58,40.42 Q21.E
N$116
  Bottom 0.508: Q22.B Q24.B Q24.C 19.05,45.5 16.51,42.96 Q23.E
N$117
  Bottom 0.508: R47.2 Q22.E
N$118
  Bottom 0.508: R48.2 Q24.E
N$119
  Top 0.356: Q17.B 36.58,72.3 32.64,76.24 IC1.8
N$120
  Top 0.356: IC1.7 25.02,74.21 24.13,73.32 17.65,73.32 16.51,72.17 Q18.B
N$136
  Bottom 0.356: IC2.2 61.61,89.45 VR9.3 57.21,89.47 R57.2
N$137
  Bottom 0.356: IC2.12 75.56,86.91 74.68,87.79 74.68,90.97 73.66,91.99 IC2.1 70.99,93.64 70.1,94.53 GS_CH10.1 66.78,94.55 VR9.1 VR9.2
N$138
  Bottom 0.356: IC2.13 80.39,89.45 81.72,90.78 R58.2 88.56,90.78 VR10.1
N$141
  Top 0.356: Q34.C 84.2,72.3 85.85,73.95 88.9,73.95 C33.2
  Top 0.508: Q34.C Q38.C 84.2,54.78 83.06,53.63 79.25,53.63 78.23,52.62 78.23,41.82 79.76,40.3 Q39.B
N$142
  Top 0.356: C34.1 56.9,79.16 57.91,79.16 | 57.91,79.16 | 57.91,79.16 64.64,72.43 Q33.C
  Top 0.508: Q33.C Q36.C
  Bottom 0.508: Q36.C 64.64,54.14 65.91,52.87 69.72,52.87 70.99,51.6 70.99,42.33 69.52,40.86 Q37.B
N$143
  Bottom 0.508: R61.1 Q36.E
N$144
  Bottom 0.508: R62.1 Q35.E
N$145
  Top 0.508: Q36.B Q35.B
  Bottom 0.508: Q37.E 61.72,43.22 64.64,46.14 Q35.C Q35.B
N$146
  Bottom 0.508: Q39.E 86.74,43.22 84.2,45.76 Q40.C Q40.B Q38.B
N$147
  Bottom 0.508: Q38.E R63.2
N$148
  Bottom 0.508: Q40.E R64.2
N$149
  Top 0.356: IC2.7 70.99,73.57 67.31,69.89 Q33.B
N$150
  Bottom 0.356: Q34.B 86.74,71.92 81.91,76.75 IC2.8
N$157
  Bottom 0.356: D31.CA RG2.1 123.16,149.99 D34.CA C68.1
N$158
  Bottom 0.356: D39.CA 123.55,109.35 RG4.1 C72.1 128.91,105.54 D37.CA
RL1
  Bottom 0.356: R13.2 35.56,118.74 UC1.6
RL2
  Bottom 0.356: UC1.7 38.1,114.21 R11.2
S_BZ
  Bottom 0.356: R23.1 UC1.9
S_CH1
  Top 0.508: Q23.C 19.05,37.5 20.32,36.23 | 20.32,36.23 38.1,36.23 | 38.1,36.23 39.24,37.38 Q21.C | 20.32,36.23 RL5.6 | RL6.6 38.1,27.66 38.1,36.23
S_CH2
  Top 0.356: 66.67,36.36 66.61,36.3 66.48,36.17
  Top 0.508: RL7.6 66.48,36.17 | 66.61,36.3 64.26,38.65 Q37.C | Q39.C 84.2,36.36 | 84.2,36.36 84.9,35.66 RL8.6 | 84.2,36.36 66.67,36.36
SCL
  Bottom 0.356: AC.SCL UC1.19/A5
SCL2
  Bottom 0.356: UC2.19/A5 AC1.SCL
SCLK
  Bottom 0.356: IC4.5 51.75,139.23 50.74,140.25 50.74,146.41 UC1.13
SCLK_ISO
  Bottom 0.356: IC4.12 86.99,139.23 89.15,137.07 89.15,122.15 86.61,119.61 78.04,119.61 77.09,120.56 DAC.SCLK
SDA
  Bottom 0.356: UC1.18/A4 AC.SDA
SDA2
  Bottom 0.356: UC2.18/A4 AC1.SDA
VREF  (via drill 0.9 pad 2)
  Top 0.356: DAC.VREFD 66.93,119.42 64.39,116.88 64.39,107.61 v57.28,100.5
  Bottom 0.356: R41.1 11.3,91.44 11.3,94.4 13.72,96.81 27.3,96.81 28.58,95.54 57.28,95.54 | R57.1 57.28,91.44 57.28,95.54 | v57.28,100.5 57.28,95.54
(copper drawn outside any net)
  shapes: Top area x617

### Text on the board
Top: ◄ V1.0 Rev20 ► / Set 2018 | 2 CHANNELS | STIMULATOR
bNames: +15 | +15HV | +8 | +5 | GND | -15 | GND_HV | +5 | -15 | -15 | -15HV | G | G | GND | G | +15_D | G | + D- D+ - | +5 | S | S | GND_D | G | G | G | S | G | S | HV- | G | GND | +5 | GND | SHUNT | SHUNT | GND | HV+ | GND | GND | S G | S G